# Altium project zxevo.PrjPcb (part 1 of 2)
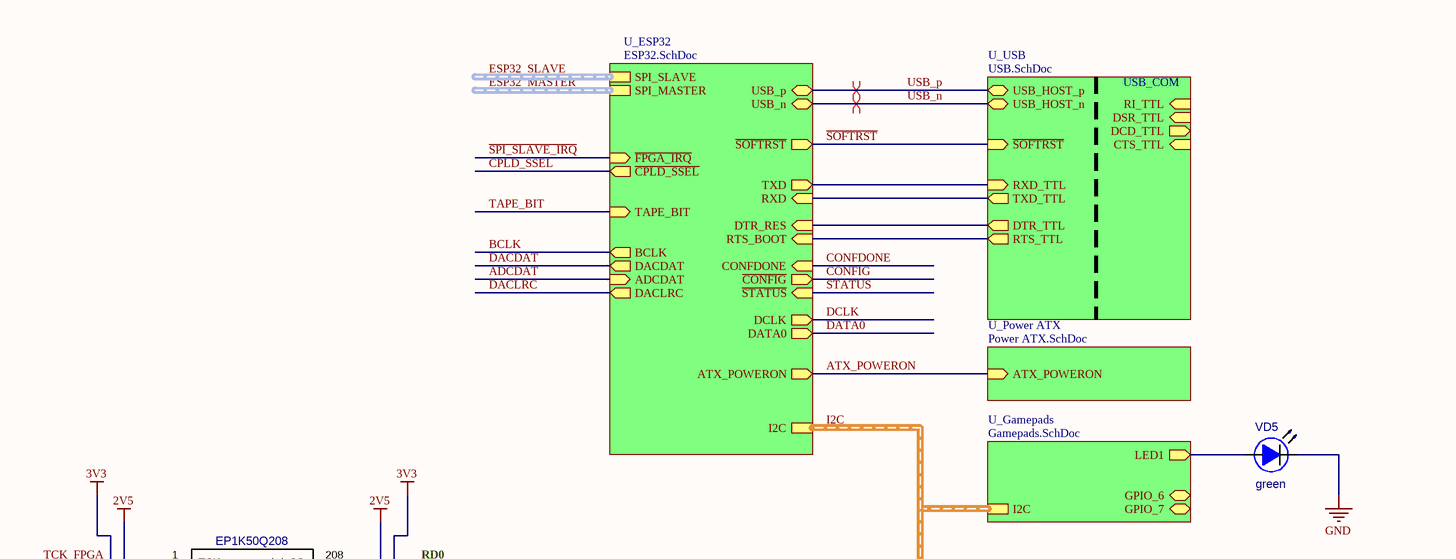
[diagram p0: FPGA.SchDoc, top]
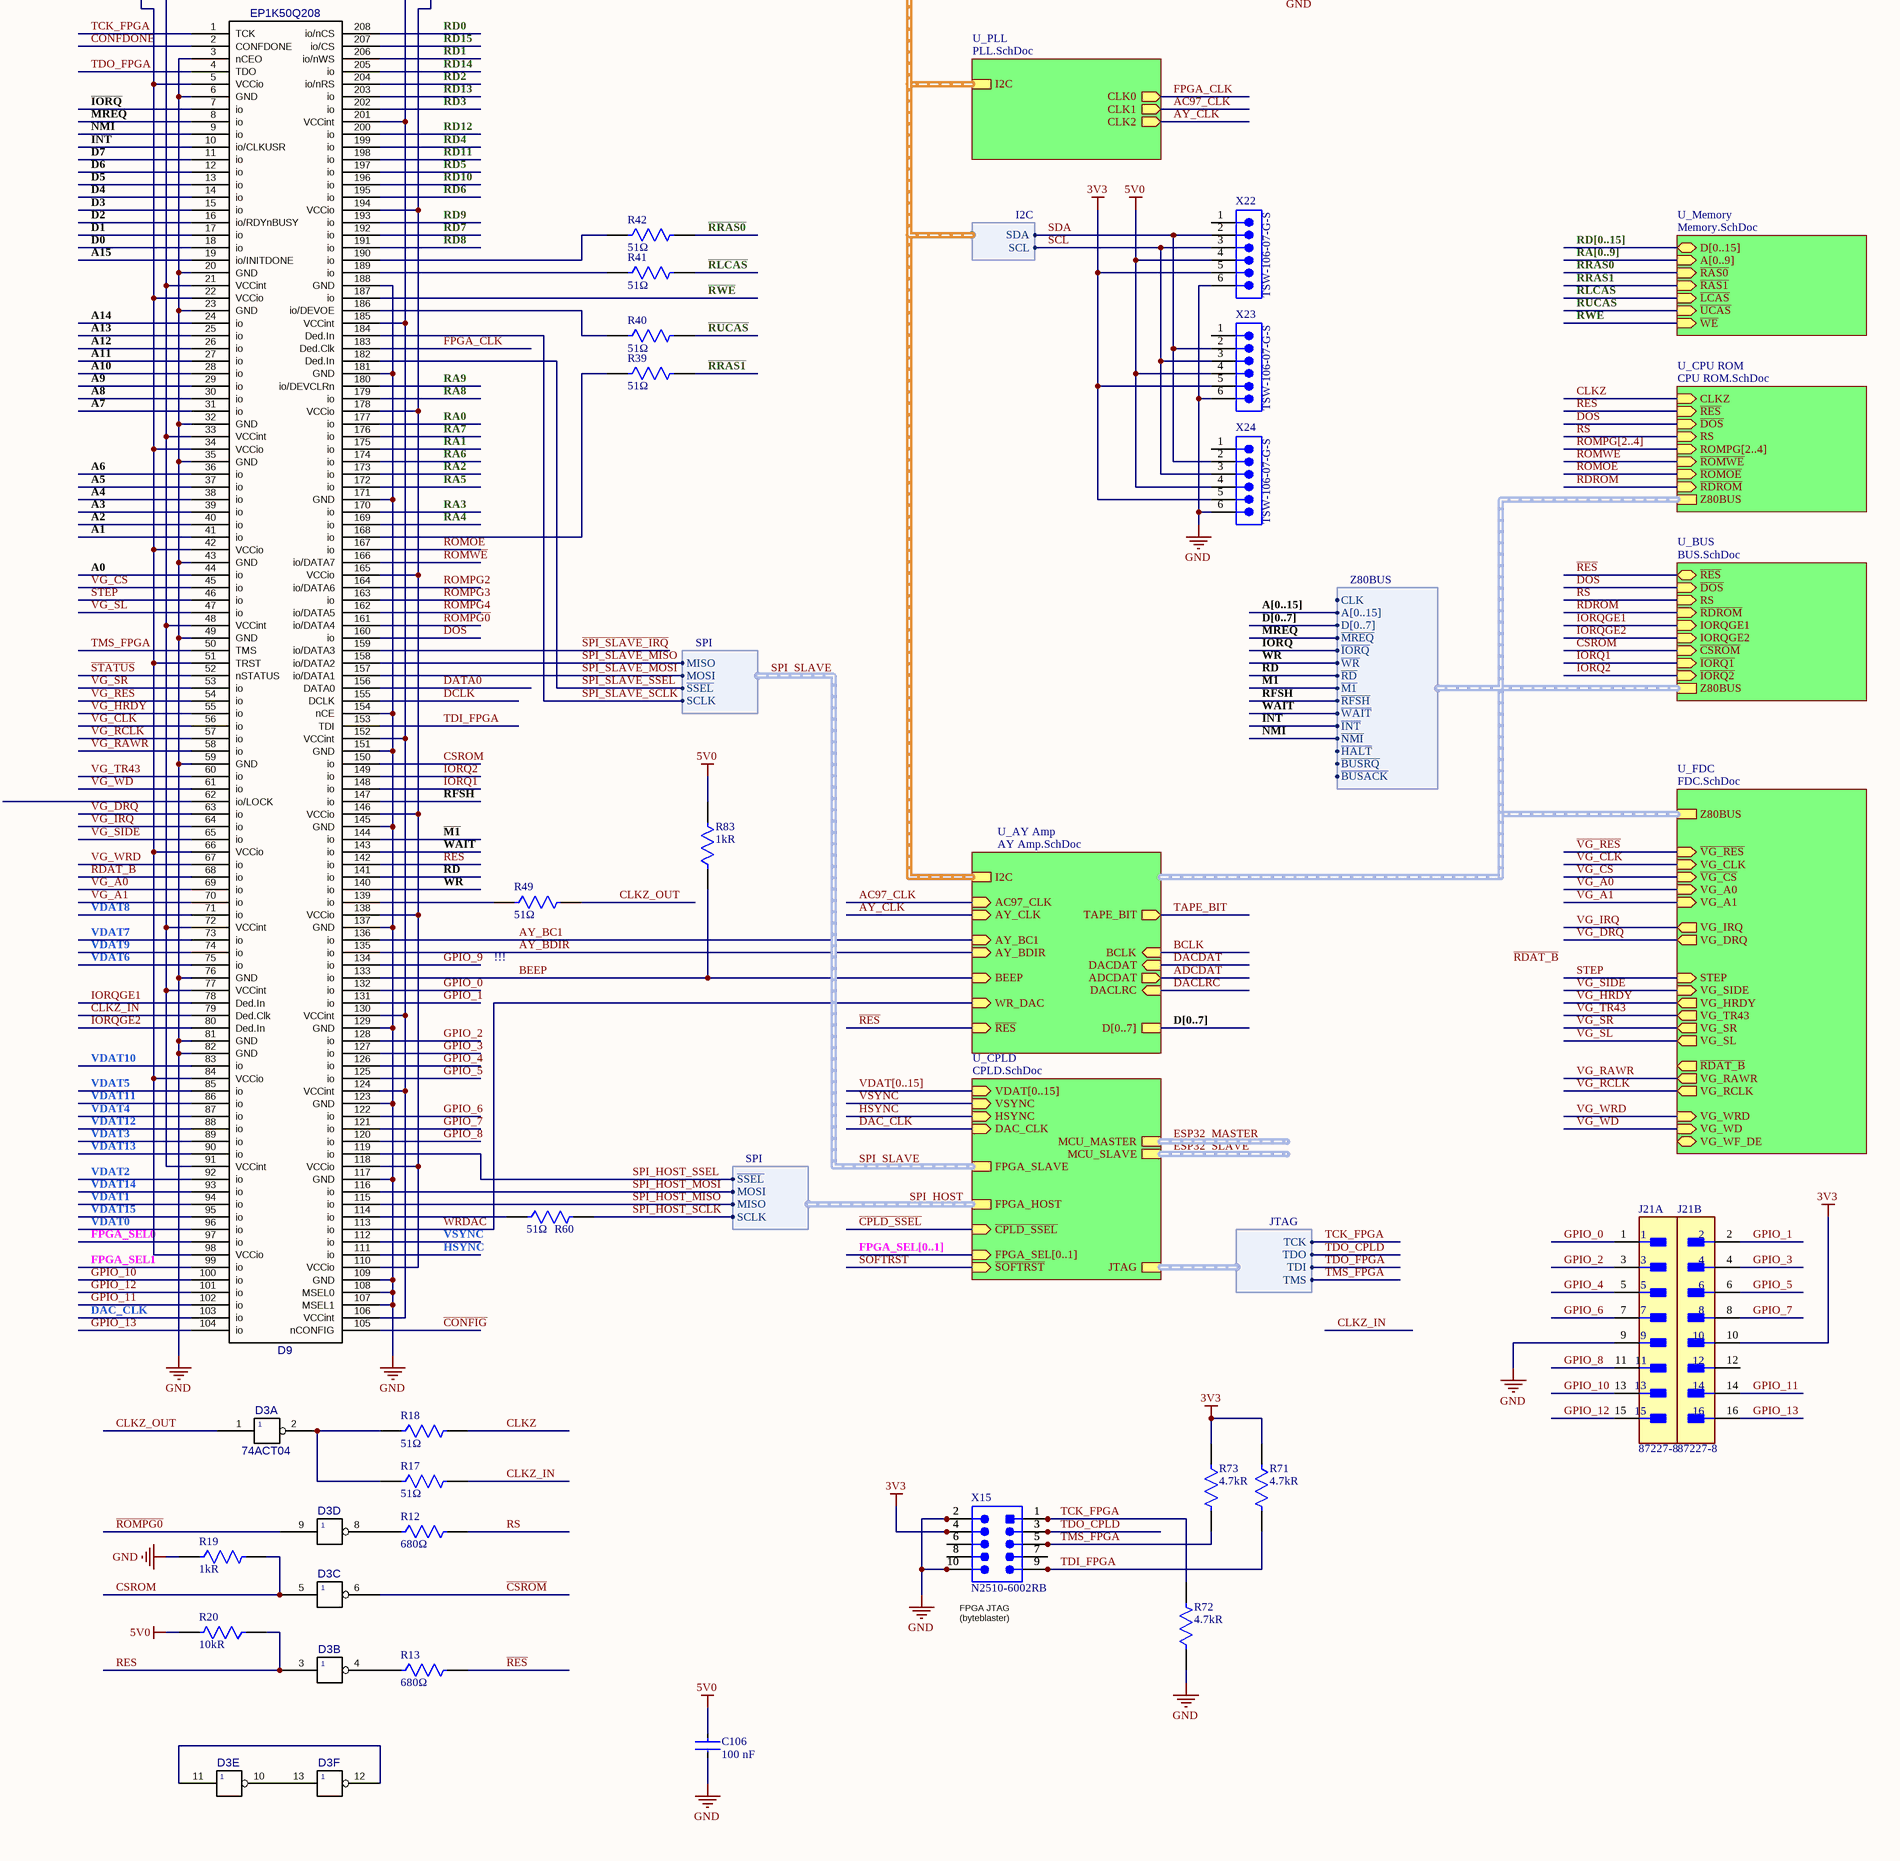
[diagram p1: FPGA.SchDoc, bottom]
9 sheets, 135 parts. Net scope: hierarchical (ports join the sheet entries above them; power ports are global).
Board file: RevA2.PcbDoc
Sheets:
  FPGA.SchDoc
    U_Memory = Memory.SchDoc
    U_BUS = BUS.SchDoc
    U_CPLD = CPLD.SchDoc
      U_Video out = Video out.SchDoc
      U_SDCARD = SDCARD.SchDoc
    U_Power ATX = Power ATX.SchDoc
    U_USB = USB.SchDoc
    U_Gamepads = Gamepads.SchDoc

## Sheet FPGA.SchDoc
size A2 portrait; SheetNumber: 1; SheetTotal: 15

### Parts
C106  Capacitance: 100 nF  [FP-CC0805-0_85-IPC_A]  (hidden comment: CC0805KRX7R9BB104)
D3  value 74ACT04  [SO14]  (hidden comment: 04)  (parts A,B,C,D,E,F of 6)
D9  EP1K50Q208  [PQFP208X5]
J21  87227-8  [FP-87227-8-MFG]  (parts A,B of 2)
R12  value 680Ω  [FP-RT0805-IPC_A]  (hidden comment: RT0805FRE07680RL)
R13  value 680Ω  [FP-RT0805-IPC_A]  (hidden comment: RT0805FRE07680RL)
R17  Resistance: 51Ω  [FP-RR1220-IPC_A]  (hidden comment: RR1220Q-510-D)
R18  Resistance: 51Ω  [FP-RR1220-IPC_A]  (hidden comment: RR1220Q-510-D)
R19  Resistance: 1kR  [FP-CRCW0805-HPe3-IPC_A]  (hidden comment: CRCW08051K00FKEAHP)
R20  Resistance: 10kR  [FP-CR0805-IPC_A]  (hidden comment: CR0805-JW-103ELF)
R39  Resistance: 51Ω  [FP-RR1220-IPC_A]  (hidden comment: RR1220Q-510-D)
R40  Resistance: 51Ω  [FP-RR1220-IPC_A]  (hidden comment: RR1220Q-510-D)
R41  Resistance: 51Ω  [FP-RR1220-IPC_A]  (hidden comment: RR1220Q-510-D)
R42  Resistance: 51Ω  [FP-RR1220-IPC_A]  (hidden comment: RR1220Q-510-D)
R49  Resistance: 51Ω  [FP-RR1220-IPC_A]  (hidden comment: RR1220Q-510-D)
R60  Resistance: 51Ω  [FP-RR1220-IPC_A]  (hidden comment: RR1220Q-510-D)
R71  Resistance: 4.7kR  [FP-CR0805-IPC_A]  (hidden comment: CR0805-JW-472ELF)
R72  Resistance: 4.7kR  [FP-CR0805-IPC_A]  (hidden comment: CR0805-JW-472ELF)
R73  Resistance: 4.7kR  [FP-CR0805-IPC_A]  (hidden comment: CR0805-JW-472ELF)
R83  Resistance: 1kR  [FP-CRCW0805-HPe3-IPC_A]  (hidden comment: CRCW08051K00FKEAHP)
VD5  value green  [LED100_LED(Primary)]  (hidden comment: LED)
X15  N2510-6002RB  [3M-N2510-6002-10_V]
X22  TSW-106-07-G-S  [SMTC-TSW-106-07-X-S]
X23  TSW-106-07-G-S  [SMTC-TSW-106-07-X-S]
X24  TSW-106-07-G-S  [SMTC-TSW-106-07-X-S]

### Sub-sheets
U_AY Amp = AY Amp.SchDoc (file not in this document): AY_BC1 (in), ~{RES} (in), AY_CLK (in), AY_BDIR (in), I2C (harness I2C), DACDAT (in), TAPE_BIT (out), ADCDAT (out), BCLK (in), BEEP (in), DACLRC (in), WR_DAC (in), D[0..7], AC97_CLK (in)
U_BUS = BUS.SchDoc: ~{RES} (bidir), ~{DOS} (in), RS (in), ~{RDROM} (in), IORQGE1 (in), IORQGE2 (in), ~{CSROM} (in), ~{IORQ1} (in), ~{IORQ2} (in), Z80BUS (harness Z80BUS)
U_CPLD = CPLD.SchDoc: VDAT[0..15] (in), VSYNC (in), HSYNC (in), DAC_CLK (in), FPGA_HOST (harness SPI), FPGA_SLAVE (harness SPI), MCU_MASTER (harness SPI), MCU_SLAVE (harness SPI), FPGA_SEL[0..1] (in), JTAG (harness JTAG), ~{SOFTRST} (in), ~{CPLD_SSEL} (in)
U_CPU ROM = CPU ROM.SchDoc (file not in this document): CLKZ (in), ~{RES} (in), ~{DOS} (in), RS (in), ROMPG[2..4] (in), ~{ROMWE} (in), ~{ROMOE} (in), ~{RDROM} (in), Z80BUS (harness Z80BUS)
U_ESP32 = ESP32.SchDoc (file not in this document): SPI_SLAVE (harness SPI), TXD (out), RXD (in), DTR_RES (in), RTS_BOOT (in), I2C (harness I2C), TAPE_BIT (in), USB_n (bidir), USB_p (bidir), SPI_MASTER (harness SPI), ~{SOFTRST} (out), ATX_POWERON (out), ~{FPGA_IRQ} (in), DCLK (out), DATA0 (out), ~{STATUS} (in), CONFDONE (in), ~{CONFIG} (out), ~{CPLD_SSEL} (out), DACLRC (out), ADCDAT (in), BCLK (out), DACDAT (out)
U_FDC = FDC.SchDoc (file not in this document): VG_CLK (in), VG_IRQ (out), VG_DRQ (out), ~{VG_CS} (in), VG_SIDE (in), STEP (in), VG_A0 (in), VG_A1 (in), VG_TR43 (out), VG_SR (out), VG_SL (out), VG_WD (in), VG_WRD (in), VG_WF_DE (bidir), VG_RAWR (out), VG_RCLK (out), ~{VG_RES} (in), VG_HRDY (out), Z80BUS (harness Z80BUS), ~{RDAT_B} (out)
U_Gamepads = Gamepads.SchDoc: GPIO_7 (bidir), LED1 (out), GPIO_6 (bidir), I2C (harness I2C)
U_Memory = Memory.SchDoc: D[0..15] (bidir), A[0..9] (in), ~{RAS0} (in), ~{RAS1} (in), ~{LCAS} (in), ~{UCAS} (in), ~{WE} (in)
U_PLL = PLL.SchDoc (file not in this document): CLK0 (out), CLK1 (out), CLK2 (out), I2C (harness I2C)
U_Power ATX = Power ATX.SchDoc: ATX_POWERON (in)
U_USB = USB.SchDoc: RXD_TTL (in), USB_HOST_p (bidir), TXD_TTL (out), RTS_TTL (out), CTS_TTL (in), DCD_TTL (out), DSR_TTL (in), USB_HOST_n (bidir), RI_TTL (in), DTR_TTL (out), ~{SOFTRST} (in)

### Harnesses
SPI: ~{SSEL}, SCLK, MOSI, MISO
JTAG: TCK, TDO, TDI, TMS
I2C: SDA, SCL
Z80BUS: A[0..15], D[0..7], ~{MREQ}, ~{IORQ}, ~{WR}, ~{RD}, ~{M1}, ~{RFSH}, ~{WAIT}, ~{INT}, ~{NMI}, ~{HALT}, ~{BUSRQ}, ~{BUSACK}, CLK

### Nets
2V5: D9.21(VCCint) D9.33(VCCint) D9.48(VCCint) D9.72(VCCint) D9.77(VCCint) D9.91(VCCint) D9.106(VCCint) D9.124(VCCint) D9.130(VCCint) D9.152(VCCint) D9.185(VCCint) D9.201(VCCint)
3V3: D9.5(VCCio) D9.22(VCCio) D9.34(VCCio) D9.42(VCCio) D9.51(TRST) D9.66(VCCio) D9.84(VCCio) D9.98(VCCio) D9.110(VCCio) D9.118(VCCio) D9.138(VCCio) D9.146(VCCio) D9.165(VCCio) D9.178(VCCio) D9.194(VCCio) J21.10 R71.1 R73.1 X15.4 X22.5 X23.5 X24.5
5V0: C106.1 R20.2 R83.2 X22.4 X23.4 X24.4
GND: C106.2 D3.7(GND) D9.3(nCEO) D9.6(GND) D9.20(GND) D9.23(GND) D9.32(GND) D9.35(GND) D9.43(GND) D9.49(GND) D9.59(GND) D9.76(GND) D9.81(GND) D9.82(GND) D9.107(MSEL1) D9.108(MSEL0) D9.109(GND) D9.117(GND) D9.123(GND) D9.129(GND) D9.137(GND) D9.145(GND) D9.151(GND) D9.154(nCE) D9.171(GND) D9.181(GND) D9.188(GND) J21.9 R19.1 R72.1 VD5.K X15.2 X15.10 X22.6 X23.6 X24.6
VCC5: D3.14(+5v)
A0: D9.44(io)
A1: D9.41(io)
A2: D9.40(io)
A3: D9.39(io)
A4: D9.38(io)
A5: D9.37(io)
A6: D9.36(io)
A7: D9.31(io)
A8: D9.30(io)
A9: D9.29(io)
A10: D9.28(io)
A11: D9.27(io)
A12: D9.26(io)
A13: D9.25(io)
A14: D9.24(io)
A15: D9.19(io/INITDONE)
AC97_CLK: sheet U_AY Amp/AC97_CLK, sheet U_PLL/CLK1
ADCDAT: sheet U_ESP32/ADCDAT, sheet U_AY Amp/ADCDAT
ATX_POWERON: sheet U_Power ATX/ATX_POWERON, sheet U_ESP32/ATX_POWERON
AY_BC1: D9.136(io) ; sheet U_AY Amp/AY_BC1
AY_BDIR: D9.135(io) ; sheet U_AY Amp/AY_BDIR
AY_CLK: sheet U_AY Amp/AY_CLK, sheet U_PLL/CLK2
BCLK: sheet U_ESP32/BCLK, sheet U_AY Amp/BCLK
BEEP: D9.133(io) R83.1 ; sheet U_AY Amp/BEEP
~{CONFIG}: D9.105(nCONFIG) ; sheet U_ESP32/~{CONFIG}
~{CPLD_SSEL}: sheet U_CPLD/~{CPLD_SSEL}, sheet U_ESP32/~{CPLD_SSEL}
~{CSROM}: D3.6 ; sheet U_BUS/~{CSROM}
CLKZ: R18.2 ; sheet U_CPU ROM/CLKZ
CLKZ_IN: D9.79(Ded.Clk) R17.2  [project net CLKZ_IN_1]
CLKZ_OUT: D3.1 R49.2  [project net CLKZ_OUT_1]
CONFDONE: D9.2(CONFDONE) ; sheet U_ESP32/CONFDONE
CSROM: D3.5 D9.150(io) R19.2  [project net CSROM_1]
D0: D9.18(io)
D1: D9.17(io)
D2: D9.16(io/RDYnBUSY)
D3: D9.15(io)
D4: D9.14(io)
D5: D9.13(io)
D6: D9.12(io)
D7: D9.11(io)
~{DOS}: D9.160(io) ; sheet U_CPU ROM/~{DOS}, sheet U_BUS/~{DOS}
DAC_CLK: D9.103(io) ; sheet U_CPLD/DAC_CLK
DACDAT: sheet U_ESP32/DACDAT, sheet U_AY Amp/DACDAT
DACLRC: sheet U_ESP32/DACLRC, sheet U_AY Amp/DACLRC
DATA0: D9.156(DATA0) ; sheet U_ESP32/DATA0
DCLK: D9.155(DCLK) ; sheet U_ESP32/DCLK
DTR_TTL: sheet U_USB/DTR_TTL, sheet U_ESP32/DTR_RES
FPGA_CLK: D9.183(Ded.Clk) ; sheet U_PLL/CLK0
FPGA_SEL0: D9.97(io)
FPGA_SEL1: D9.99(io)
GPIO_0: D9.132(io) J21.1  [project net GPIO_0_1]
GPIO_1: D9.131(io) J21.2  [project net GPIO_1_1]
GPIO_2: D9.128(io) J21.3  [project net GPIO_2_1]
GPIO_3: D9.127(io) J21.4  [project net GPIO_3_1]
GPIO_4: D9.126(io) J21.5  [project net GPIO_4_1]
GPIO_5: D9.125(io) J21.6  [project net GPIO_5_1]
GPIO_6: D9.122(io) J21.7  [project net GPIO_6_1]
GPIO_7: D9.121(io) J21.8  [project net GPIO_7_1]
GPIO_8: D9.120(io) J21.11  [project net GPIO_8_1]
GPIO_9: D9.134(io)  [project net GPIO_9_1]
GPIO_10: D9.100(io) J21.13  [project net GPIO_10_1]
GPIO_11: D9.102(io) J21.14  [project net GPIO_11_1]
GPIO_12: D9.101(io) J21.15  [project net GPIO_12_1]
GPIO_13: D9.104(io) J21.16  [project net GPIO_13_1]
HSYNC: D9.111(io) ; sheet U_CPLD/HSYNC
~{INT}: D9.10(io/CLKUSR) ; sheet U_CPU ROM/Z80BUS.~{INT}
~{IORQ}: D9.7(io) ; sheet U_CPU ROM/Z80BUS.~{IORQ}
~{IORQ1}: D9.148(io) ; sheet U_BUS/~{IORQ1}
~{IORQ2}: D9.149(io) ; sheet U_BUS/~{IORQ2}
IORQGE1: D9.78(Ded.In) ; sheet U_BUS/IORQGE1
IORQGE2: D9.80(Ded.In) ; sheet U_BUS/IORQGE2
~{M1}: D9.144(io) ; sheet U_CPU ROM/Z80BUS.~{M1}
~{MREQ}: D9.8(io) ; sheet U_CPU ROM/Z80BUS.~{MREQ}
~{NMI}: D9.9(io) ; sheet U_CPU ROM/Z80BUS.~{NMI}
~{RD}: D9.141(io) ; sheet U_CPU ROM/Z80BUS.~{RD}
~{RDAT_B}: D9.68(io)  [project net ~{RDAT_B}_1]
~{RDROM}: sheet U_CPU ROM/~{RDROM}, sheet U_BUS/~{RDROM}
~{RES}: R13.2 ; sheet U_CPU ROM/~{RES}, sheet U_BUS/~{RES}, sheet U_AY Amp/~{RES}
~{RFSH}: D9.147(io) ; sheet U_CPU ROM/Z80BUS.~{RFSH}
~{RLCAS}: R41.2 ; sheet U_Memory/~{LCAS}
~{ROMOE}: D9.167(io) ; sheet U_CPU ROM/~{ROMOE}
~{ROMPG0}: D3.9 D9.161(io/DATA4)  [project net ~{ROMPG0}_1]
~{ROMWE}: D9.166(io/DATA7) ; sheet U_CPU ROM/~{ROMWE}
~{RRAS0}: R42.2 ; sheet U_Memory/~{RAS0}
~{RRAS1}: R39.2 ; sheet U_Memory/~{RAS1}
~{RUCAS}: R40.2 ; sheet U_Memory/~{UCAS}
~{RWE}: D9.187(io) ; sheet U_Memory/~{WE}
RA0: D9.177(io)
RA1: D9.175(io)
RA2: D9.173(io)
RA3: D9.170(io)
RA4: D9.169(io)
RA5: D9.172(io)
RA6: D9.174(io)
RA7: D9.176(io)
RA8: D9.179(io)
RA9: D9.180(io/DEVCLRn)
RD0: D9.208(io/nCS)
RD1: D9.206(io/nWS)
RD2: D9.204(io/nRS)
RD3: D9.202(io)
RD4: D9.199(io)
RD5: D9.197(io)
RD6: D9.195(io)
RD7: D9.192(io)
RD8: D9.191(io)
RD9: D9.193(io)
RD10: D9.196(io)
RD11: D9.198(io)
RD12: D9.200(io)
RD13: D9.203(io)
RD14: D9.205(io)
RD15: D9.207(io/CS)
RES: D3.3 D9.142(io) R20.1  [project net RES_1]
ROMPG2: D9.164(io/DATA6)  [project net ROMPG2_1]
ROMPG3: D9.163(io)  [project net ROMPG3_1]
ROMPG4: D9.162(io/DATA5)  [project net ROMPG4_1]
RS: R12.2 ; sheet U_CPU ROM/RS, sheet U_BUS/RS
RTS_TTL: sheet U_USB/RTS_TTL, sheet U_ESP32/RTS_BOOT
RXD_TTL: sheet U_USB/RXD_TTL, sheet U_ESP32/TXD
~{SOFTRST}: sheet U_CPLD/~{SOFTRST}, sheet U_USB/~{SOFTRST}, sheet U_ESP32/~{SOFTRST}
~{SPI_SLAVE_IRQ}: D9.159(io/DATA3) ; sheet U_ESP32/~{FPGA_IRQ}
~{SPI_SLAVE_SSEL}: D9.182(Ded.In) ; sheet U_CPLD/FPGA_SLAVE.~{SSEL}
~{STATUS}: D9.52(nSTATUS) ; sheet U_ESP32/~{STATUS}
SCL: X22.3 X23.3 X24.3 ; sheet U_ESP32/I2C.SCL  [project net I2C.SCL]
SDA: X22.2 X23.2 X24.2 ; sheet U_ESP32/I2C.SDA  [project net I2C.SDA]
SPI_HOST_MISO: D9.115(io) ; sheet U_CPLD/FPGA_HOST.MISO  [project net SPI_HOST.MISO]
SPI_HOST_MOSI: D9.116(io) ; sheet U_CPLD/FPGA_HOST.MOSI  [project net SPI_HOST.MOSI]
SPI_HOST_SCLK: R60.2 ; sheet U_CPLD/FPGA_HOST.SCLK  [project net SPI_HOST.SCLK]
SPI_HOST_SSEL: D9.119(io) ; sheet U_CPLD/FPGA_HOST.~{SSEL}  [project net SPI_HOST.~{SSEL}]
SPI_SLAVE_MISO: D9.158(io/DATA2) ; sheet U_CPLD/FPGA_SLAVE.MISO  [project net SPI_SLAVE.MISO]
SPI_SLAVE_MOSI: D9.157(io/DATA1) ; sheet U_CPLD/FPGA_SLAVE.MOSI  [project net SPI_SLAVE.MOSI]
SPI_SLAVE_SCLK: D9.184(Ded.In) ; sheet U_CPLD/FPGA_SLAVE.SCLK  [project net SPI_SLAVE.SCLK]
STEP: D9.46(io) ; sheet U_FDC/STEP
TAPE_BIT: sheet U_ESP32/TAPE_BIT, sheet U_AY Amp/TAPE_BIT
TCK_FPGA: D9.1(TCK) R72.2 X15.1 ; sheet U_CPLD/JTAG.TCK
TDI_FPGA: D9.153(TDI) R71.2 X15.9  [project net TDI_FPGA_1]
TDO_CPLD: X15.3 ; sheet U_CPLD/JTAG.TDO
TDO_FPGA: D9.4(TDO) ; sheet U_CPLD/JTAG.TDI
TMS_FPGA: D9.50(TMS) R73.2 X15.5 ; sheet U_CPLD/JTAG.TMS
TXD_TTL: sheet U_USB/TXD_TTL, sheet U_ESP32/RXD
USB_n: sheet U_USB/USB_HOST_n, sheet U_ESP32/USB_n
USB_p: sheet U_USB/USB_HOST_p, sheet U_ESP32/USB_p
~{VG_CS}: D9.45(io) ; sheet U_FDC/~{VG_CS}
~{VG_RES}: D9.54(io) ; sheet U_FDC/~{VG_RES}
VDAT0: D9.96(io)
VDAT1: D9.94(io)
VDAT2: D9.92(io)
VDAT3: D9.89(io)
VDAT4: D9.87(io)
VDAT5: D9.85(io)
VDAT6: D9.75(io)
VDAT7: D9.73(io)
VDAT8: D9.71(io)
VDAT9: D9.74(io)
VDAT10: D9.83(io)
VDAT11: D9.86(io)
VDAT12: D9.88(io)
VDAT13: D9.90(io)
VDAT14: D9.93(io)
VDAT15: D9.95(io)
VG_A0: D9.69(io) ; sheet U_FDC/VG_A0
VG_A1: D9.70(io) ; sheet U_FDC/VG_A1
VG_CLK: D9.56(io) ; sheet U_FDC/VG_CLK
VG_DRQ: D9.63(io) ; sheet U_FDC/VG_DRQ
VG_HRDY: D9.55(io) ; sheet U_FDC/VG_HRDY
VG_IRQ: D9.64(io) ; sheet U_FDC/VG_IRQ
VG_RAWR: D9.58(io) ; sheet U_FDC/VG_RAWR
VG_RCLK: D9.57(io) ; sheet U_FDC/VG_RCLK
VG_SIDE: D9.65(io) ; sheet U_FDC/VG_SIDE
VG_SL: D9.47(io) ; sheet U_FDC/VG_SL
VG_SR: D9.53(io) ; sheet U_FDC/VG_SR
VG_TR43: D9.60(io) ; sheet U_FDC/VG_TR43
VG_WD: D9.61(io) ; sheet U_FDC/VG_WD
VG_WRD: D9.67(io) ; sheet U_FDC/VG_WRD
VSYNC: D9.112(io) ; sheet U_CPLD/VSYNC
~{WAIT}: D9.143(io) ; sheet U_CPU ROM/Z80BUS.~{WAIT}
~{WR}: D9.140(io) ; sheet U_CPU ROM/Z80BUS.~{WR}
WRDAC: D9.113(io) ; sheet U_AY Amp/WR_DAC
NetD3_2: D3.2 R17.1 R18.1
NetD3_4: D3.4 R13.1
NetD3_8: D3.8 R12.1
NetD3_10: D3.10 D3.13
NetD3_11: D3.11 D3.12
NetD9_114: D9.114(io) R60.1
NetD9_139: D9.139(io) R49.1
NetD9_168: D9.168(io) R39.1
NetD9_186: D9.186(io/DEVOE) R40.1
NetD9_189: D9.189(io) R41.1
NetD9_190: D9.190(io) R42.1
NetR74_1: VD5.A ; sheet U_Gamepads/LED1

Not connected (* = marked no-connect by the designer): D9 62(io/LOCK); J21 12; X15 6 7 8; X22 1; X23 1; X24 1

### Buses and harness runs
bus A[0..15]
bus D[0..7]
bus D[0..7] = sheet U_AY Amp/D[0..7]
bus FPGA_SEL[0..1] = sheet U_CPLD/FPGA_SEL[0..1]
bus RA[0..9] = sheet U_Memory/A[0..9]
bus RD[0..15] = sheet U_Memory/D[0..15]
bus ROMPG[2..4] = sheet U_CPU ROM/ROMPG[2..4]
bus VDAT[0..15] = sheet U_CPLD/VDAT[0..15]
harness ESP32_MASTER = sheet U_CPLD/MCU_MASTER
harness ESP32_MASTER = sheet U_ESP32/SPI_MASTER
harness ESP32_SLAVE = sheet U_CPLD/MCU_SLAVE
harness ESP32_SLAVE = sheet U_ESP32/SPI_SLAVE
harness I2C = sheet U_AY Amp/I2C = sheet U_ESP32/I2C = sheet U_Gamepads/I2C = sheet U_PLL/I2C
harness sheet U_BUS/Z80BUS = sheet U_CPU ROM/Z80BUS = sheet U_FDC/Z80BUS
harness SPI_HOST = sheet U_CPLD/FPGA_HOST
harness SPI_SLAVE = sheet U_CPLD/FPGA_SLAVE

### Layout directives
differential pair: USB_n, USB_p

### Notes on the sheet
- USB_COM
- !!!
- (near X15) FPGA JTAG
  (byteblaster)
- Labels drawn without touching a wire or pin: ~{RDAT_B}

### Library data of the parts
C106 = CMP-2100-03606-3: CAP CER 0.1UF 50V X7R 0805; Manufacturer: Yageo; Value: 100 nF; Manufacturer Part Number: CC0805KRX7R9BB104; Category: Cap; Case/Package: 0805
J21 = CMP-03369-000064-1: CONN HEADER VERT 16POS 2.54MM; Manufacturer: TE Connectivity; value: HEADER 16POS 2.54MM 2ROW; Pitch: 2.54mm; Manufacturer Part Number: 87227-8; Category: Connector; Case/Package: PLD-16
R12 R13 = CMP-03412-000082-1: RES SMD 680 OHM 1% 1/8W 0805; Manufacturer: Yageo; Category: Res; Manufacturer Part Number: RT0805FRE07680RL; Resistance: 680Ω; Case/Package: 0805
R17 R18 R39-R42 R49 R60 = CMP-2001-03561-2: 51Ω ±0.5% 0.1W 1/10W Chip Resistor 0805 (2012 Metric) Thin Film; Manufacturer: Susumu; Case/Package: 0805; Number of Terminations: 2; Termination: SMD/SMT; Number of Pins: 2; Manufacturer Part Number: RR1220Q-510-D; value: 51Ω; Category: Res
R19 R83 = CMP-02407-004529-1: RES Thick Film, 1kΩ, 1%, 0.5W, 100ppm/°C, 0805; Manufacturer: Vishay Dale; Case/Package: 0805; Number of Pins: 2; Termination: Solder; Manufacturer Part Number: CRCW08051K00FKEAHP; value: 1kΩ; Category: Res
R20 = CMP-07231-003873-1: Thick Film Chip Resistors 0805 10kΩ 0.125W 5% 200ppm/°C; Manufacturer: Bourns; value: 10kΩ; Manufacturer Part Number: CR0805-JW-103ELF; Number of Terminations: 2; Termination: SMD/SMT; Number of Pins: 2; Case/Package: 0805; Category: Res
R71-R73 = CMP-07231-004713-1: Thick Film Chip Resistors 0805 4.7kΩ 0.125W 5% 200ppm/°C; Manufacturer: Bourns; Case/Package: 0805; Number of Terminations: 2; Termination: SMD/SMT; Manufacturer Part Number: CR0805-JW-472ELF; value: 4.7kΩ; Category: Res
VD5 = LED: Light Emitting Diode; Category: Diode
X15 = CMP-2000-06794-1: Male Header, Pitch 2.54 mm, 2 x 5 Postion, Height 9.91 mm, Tail Length 2.84 mm, -55 to 105 degC, RoHS, Bulk; PartNumber: N2510; Manufacturer: 3M; Pitch: 2.54mm; value: 10-Pin Shrouded Header, 2.54mm; Manufacturer Part Number: N2510-6002RB; Case/Package: IDC-10; Category: Connector
X22-X24 = CMP-1024-00383-1: 0.025" SQ Post Header, Through-hole, Vertical, -55 to 125 degC, 2.54 mm Pitch, 6-Pin, Male, RoHS; Manufacturer: Samtec; Pitch: 2.54 mm; value: 6 pin header 2.54mm; PackageDescription: .025[0.64] SQ. Post Terminal Strip Assembly; PartNumber: TSW-106-07-G-S; Manufacturer Part Number: TSW-106-07-G-S; Case/Package: PLS-6; Category: Connector
D3 = 04: Case/Package: SOIC-14; Category: IC
D9 = EP1K50Q208: Value: EP1K50Q208; Case/Package: PQFP-208; Category: IC

## Sheet Memory.SchDoc
size A4; SheetNumber: 6; SheetTotal: 15
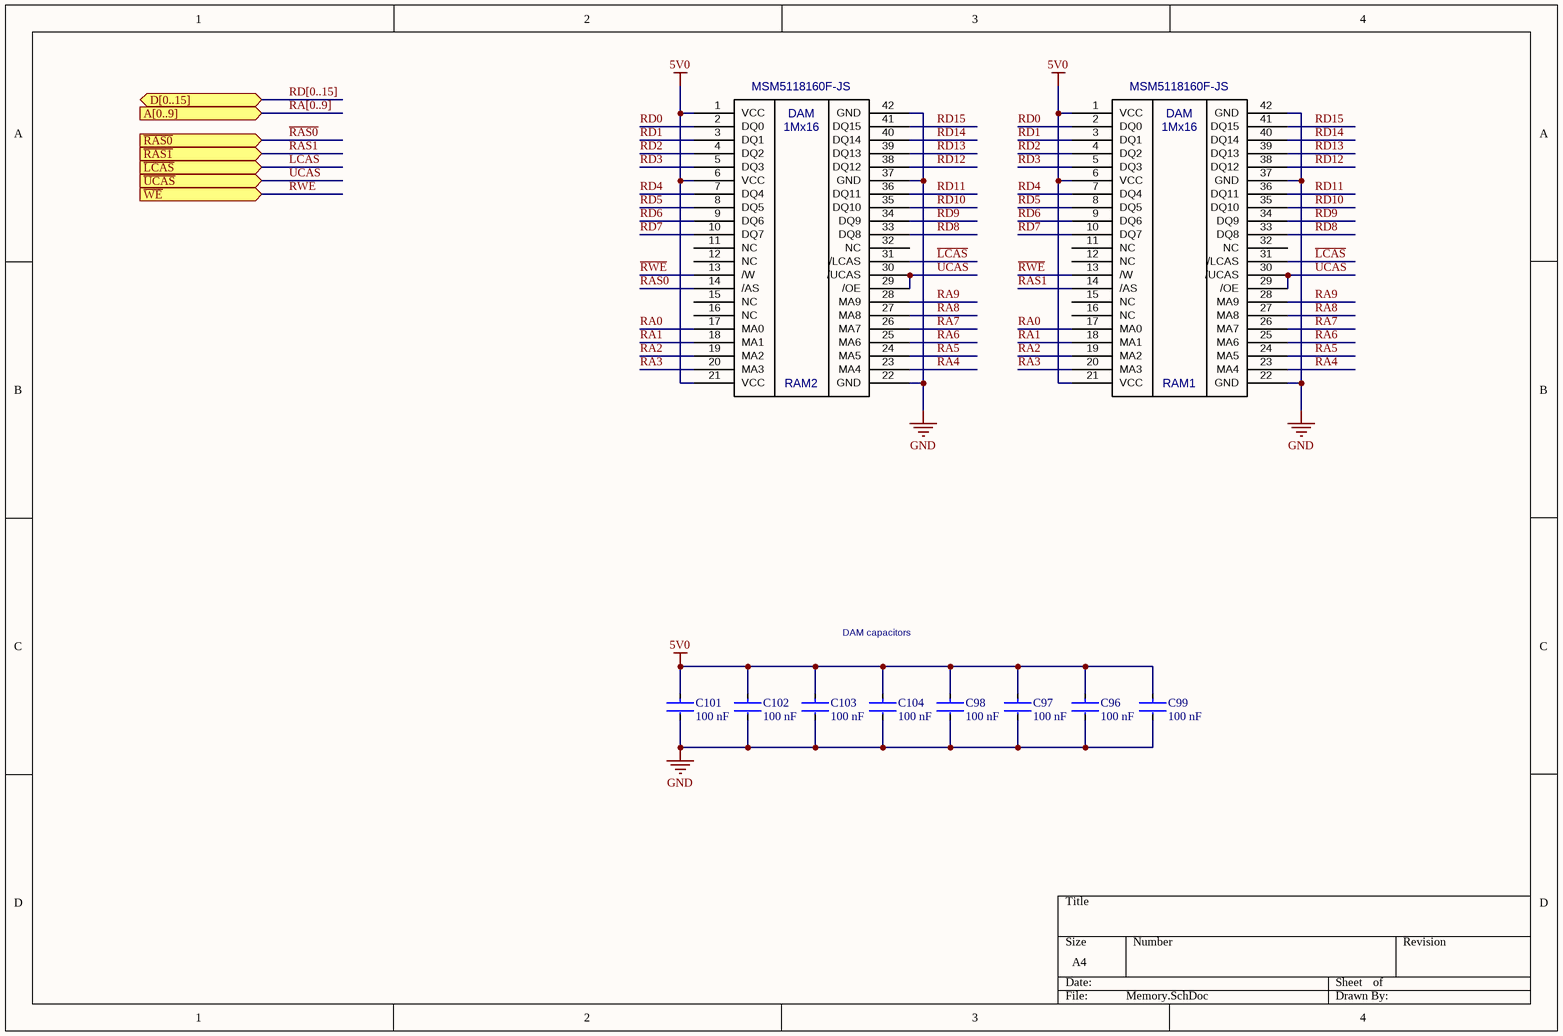
[diagram p2: Memory.SchDoc]

### Parts
C96  Capacitance: 100 nF  [FP-CC0805-0_85-IPC_A]  (hidden comment: CC0805KRX7R9BB104)
C97  Capacitance: 100 nF  [FP-CC0805-0_85-IPC_A]  (hidden comment: CC0805KRX7R9BB104)
C98  Capacitance: 100 nF  [FP-CC0805-0_85-IPC_A]  (hidden comment: CC0805KRX7R9BB104)
C99  Capacitance: 100 nF  [FP-CC0805-0_85-IPC_A]  (hidden comment: CC0805KRX7R9BB104)
C101  Capacitance: 100 nF  [FP-CC0805-0_85-IPC_A]  (hidden comment: CC0805KRX7R9BB104)
C102  Capacitance: 100 nF  [FP-CC0805-0_85-IPC_A]  (hidden comment: CC0805KRX7R9BB104)
C103  Capacitance: 100 nF  [FP-CC0805-0_85-IPC_A]  (hidden comment: CC0805KRX7R9BB104)
C104  Capacitance: 100 nF  [FP-CC0805-0_85-IPC_A]  (hidden comment: CC0805KRX7R9BB104)
RAM1  MSM5118160F-JS  [SOJ42]
RAM2  MSM5118160F-JS  [SOJ42]

### Ports
A[0..9] (in), D[0..15] (bidir), ~{LCAS} (in), ~{RAS0} (in), ~{RAS1} (in), ~{UCAS} (in), ~{WE} (in)

### Nets
5V0: C96.1 C97.1 C98.1 C99.1 C101.1 C102.1 C103.1 C104.1 RAM1.1(VCC) RAM1.6(VCC) RAM1.21(VCC) RAM2.1(VCC) RAM2.6(VCC) RAM2.21(VCC)
GND: C96.2 C97.2 C98.2 C99.2 C101.2 C102.2 C103.2 C104.2 RAM1.22(GND) RAM1.37(GND) RAM1.42(GND) RAM2.22(GND) RAM2.37(GND) RAM2.42(GND)
~{LCAS}: RAM1.31(/LCAS) RAM2.31(/LCAS) ; port ~{LCAS}  [project net ~{RLCAS}]
~{RAS0}: RAM2.14(/AS) ; port ~{RAS0}  [project net ~{RRAS0}]
~{RAS1}: RAM1.14(/AS) ; port ~{RAS1}  [project net ~{RRAS1}]
~{RWE}: RAM1.13(/W) RAM2.13(/W) ; port ~{WE}
RA0: RAM1.17(MA0) RAM2.17(MA0)
RA1: RAM1.18(MA1) RAM2.18(MA1)
RA2: RAM1.19(MA2) RAM2.19(MA2)
RA3: RAM1.20(MA3) RAM2.20(MA3)
RA4: RAM1.23(MA4) RAM2.23(MA4)
RA5: RAM1.24(MA5) RAM2.24(MA5)
RA6: RAM1.25(MA6) RAM2.25(MA6)
RA7: RAM1.26(MA7) RAM2.26(MA7)
RA8: RAM1.27(MA8) RAM2.27(MA8)
RA9: RAM1.28(MA9) RAM2.28(MA9)
RD0: RAM1.2(DQ0) RAM2.2(DQ0)
RD1: RAM1.3(DQ1) RAM2.3(DQ1)
RD2: RAM1.4(DQ2) RAM2.4(DQ2)
RD3: RAM1.5(DQ3) RAM2.5(DQ3)
RD4: RAM1.7(DQ4) RAM2.7(DQ4)
RD5: RAM1.8(DQ5) RAM2.8(DQ5)
RD6: RAM1.9(DQ6) RAM2.9(DQ6)
RD7: RAM1.10(DQ7) RAM2.10(DQ7)
RD8: RAM1.33(DQ8) RAM2.33(DQ8)
RD9: RAM1.34(DQ9) RAM2.34(DQ9)
RD10: RAM1.35(DQ10) RAM2.35(DQ10)
RD11: RAM1.36(DQ11) RAM2.36(DQ11)
RD12: RAM1.38(DQ12) RAM2.38(DQ12)
RD13: RAM1.39(DQ13) RAM2.39(DQ13)
RD14: RAM1.40(DQ14) RAM2.40(DQ14)
RD15: RAM1.41(DQ15) RAM2.41(DQ15)
~{UCAS}: RAM1.29(/OE) RAM1.30(/UCAS) RAM2.29(/OE) RAM2.30(/UCAS) ; port ~{UCAS}  [project net ~{RUCAS}]

Not connected (* = marked no-connect by the designer): RAM1 11(NC) 12(NC) 15(NC) 16(NC) 32(NC); RAM2 11(NC) 12(NC) 15(NC) 16(NC) 32(NC)

### Buses and harness runs
bus RA[0..9] = port A[0..9]
bus RD[0..15] = port D[0..15]

### Notes on the sheet
- DAM capacitors
- (in symbol MSM5118160F-JS) DAM; 1Mx16

### Library data of the parts
C96-C99 C101-C104 = CMP-2100-03606-3: as C106 on sheet FPGA; Manufacturer Part Number: CC0805KRX7R9BB104; Category: Cap; Case/Package: 0805
RAM1 RAM2 = MSM5118160F-JS: Value: MSM5118160F-JS; Case/Package: SOJ-42; Category: IC

## Sheet BUS.SchDoc
size A4; SheetNumber: 8; SheetTotal: 15
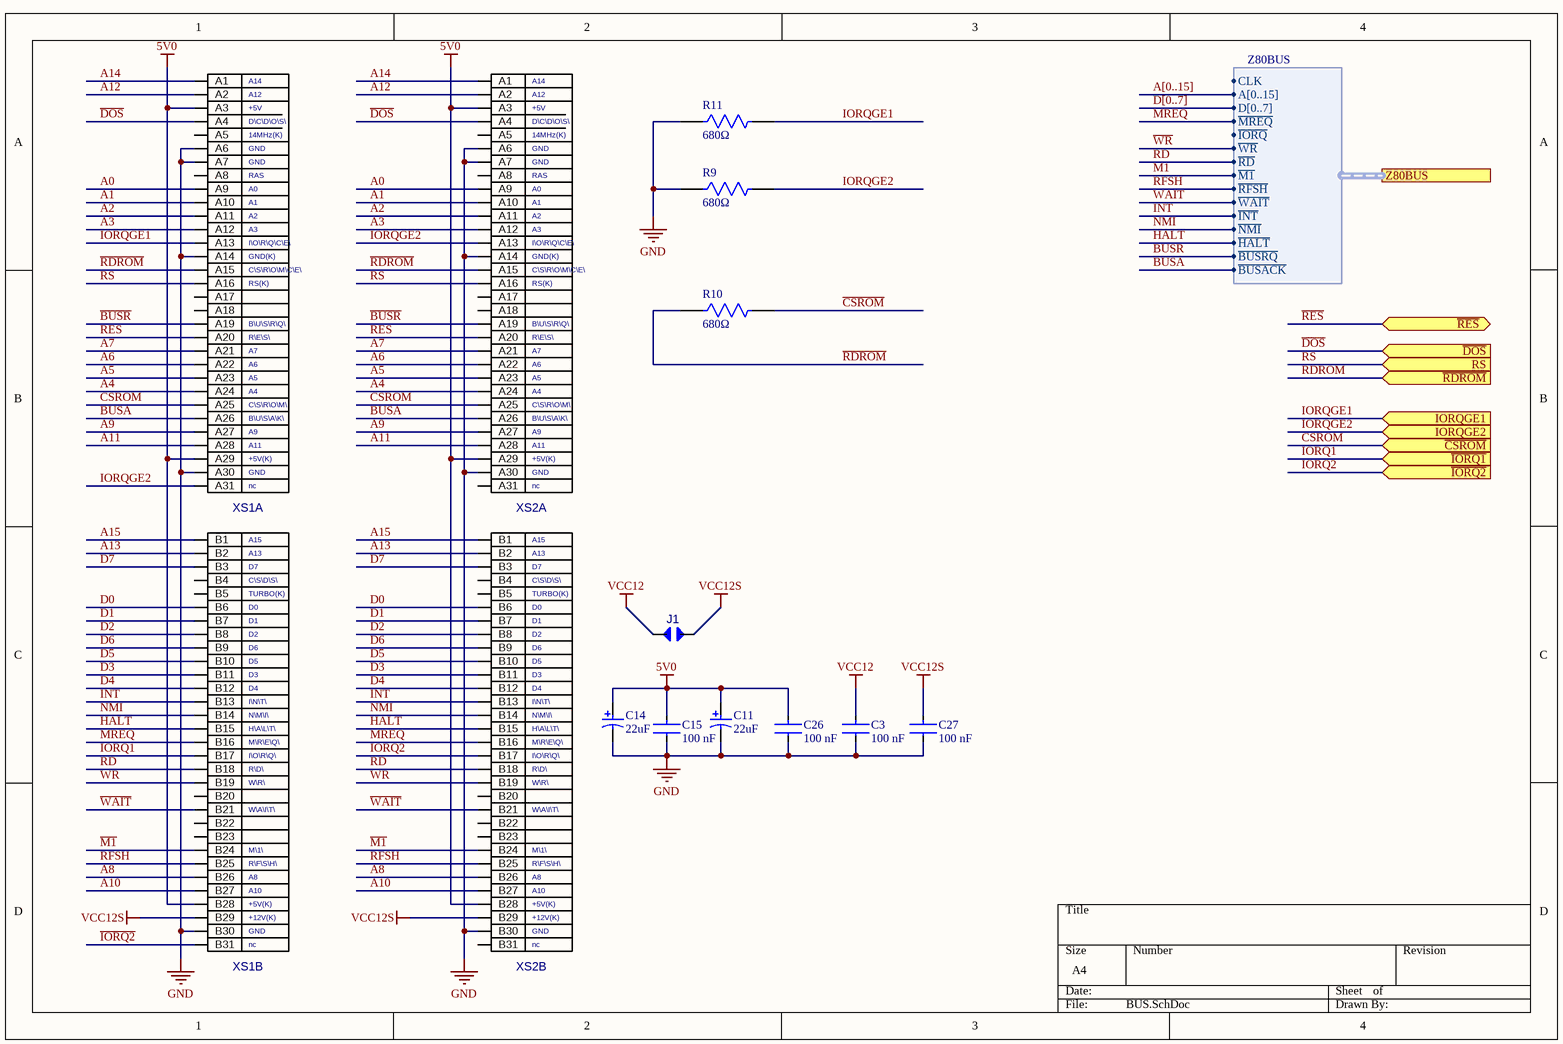
[diagram p3: BUS.SchDoc]

### Parts
C3  Capacitance: 100 nF  [FP-CC0805-0_85-IPC_A]  (hidden comment: CC0805KRX7R9BB104)
C11  Capacitance: 22uF  [AVX-TAJ-B-2_M]  (hidden comment: TAJB226K016RNJ)
C14  Capacitance: 22uF  [AVX-TAJ-B-2_M]  (hidden comment: TAJB226K016RNJ)
C15  Capacitance: 100 nF  [FP-CC0805-0_85-IPC_A]  (hidden comment: CC0805KRX7R9BB104)
C26  Capacitance: 100 nF  [FP-CC0805-0_85-IPC_A]  (hidden comment: CC0805KRX7R9BB104)
C27  Capacitance: 100 nF  [FP-CC0805-0_85-IPC_A]  (hidden comment: CC0805KRX7R9BB104)
J1  JUMPER  [JUMPER_JUMPER(Primary)]  (value not drawn)
R9  value 680Ω  [FP-RT0805-IPC_A]  (hidden comment: RT0805FRE07680RL)
R10  value 680Ω  [FP-RT0805-IPC_A]  (hidden comment: RT0805FRE07680RL)
R11  value 680Ω  [FP-RT0805-IPC_A]  (hidden comment: RT0805FRE07680RL)
XS1  ZXSLOT  [SLOT62_ZXSLOT(Primary)]  (value not drawn)  (parts A,B of 2)
XS2  ZXSLOT  [SLOT62_ZXSLOT(Primary)]  (value not drawn)  (parts A,B of 2)

### Ports
IORQGE1 (in), IORQGE2 (in), RS (in), Z80BUS (harness Z80BUS), ~{CSROM} (in), ~{DOS} (in), ~{IORQ1} (in), ~{IORQ2} (in), ~{RDROM} (in), ~{RES} (bidir)

### Harnesses
Z80BUS: A[0..15], D[0..7], ~{MREQ}, ~{IORQ}, ~{WR}, ~{RD}, ~{M1}, ~{RFSH}, ~{WAIT}, ~{INT}, ~{NMI}, ~{HALT}, ~{BUSRQ}, ~{BUSACK}, CLK

### Nets
5V0: C11.1 C14.1 C15.1 C26.1 XS1.A3 XS1.A29 XS1.B28 XS2.A3 XS2.A29 XS2.B28
GND: C3.2 C11.2 C14.2 C15.2 C26.2 C27.2 R9.1 R11.1 XS1.A6 XS1.A7 XS1.A14 XS1.A30 XS1.B30 XS2.A6 XS2.A7 XS2.A14 XS2.A30 XS2.B30
VCC12: C3.1 J1.0
VCC12S: C27.1 J1.1 XS1.B29 XS2.B29
A0: XS1.A9 XS2.A9
A1: XS1.A10 XS2.A10
A2: XS1.A11 XS2.A11
A3: XS1.A12 XS2.A12
A4: XS1.A24 XS2.A24
A5: XS1.A23 XS2.A23
A6: XS1.A22 XS2.A22
A7: XS1.A21 XS2.A21
A8: XS1.B26 XS2.B26
A9: XS1.A27 XS2.A27
A10: XS1.B27 XS2.B27
A11: XS1.A28 XS2.A28
A12: XS1.A2 XS2.A2
A13: XS1.B2 XS2.B2
A14: XS1.A1 XS2.A1
A15: XS1.B1 XS2.B1
~{BUSA}: XS1.A26 XS2.A26 ; port Z80BUS.~{BUSACK}
~{BUSR}: XS1.A19 XS2.A19 ; port Z80BUS.~{BUSRQ}
~{CSROM}: R10.2 XS1.A25 XS2.A25 ; port ~{CSROM}
D0: XS1.B6 XS2.B6
D1: XS1.B7 XS2.B7
D2: XS1.B8 XS2.B8
D3: XS1.B11 XS2.B11
D4: XS1.B12 XS2.B12
D5: XS1.B10 XS2.B10
D6: XS1.B9 XS2.B9
D7: XS1.B3 XS2.B3
~{DOS}: XS1.A4 XS2.A4 ; port ~{DOS}
~{HALT}: XS1.B15 XS2.B15 ; port Z80BUS.~{HALT}
~{INT}: XS1.B13 XS2.B13 ; port Z80BUS.~{INT}
~{IORQ1}: XS1.B17 ; port ~{IORQ1}
~{IORQ2}: XS1.B31 XS2.B17 ; port ~{IORQ2}
IORQGE1: R11.2 XS1.A13 ; port IORQGE1
IORQGE2: R9.2 XS1.A31 XS2.A13 ; port IORQGE2
~{M1}: XS1.B24 XS2.B24 ; port Z80BUS.~{M1}
~{MREQ}: XS1.B16 XS2.B16 ; port Z80BUS.~{MREQ}
~{NMI}: XS1.B14 XS2.B14 ; port Z80BUS.~{NMI}
~{RD}: XS1.B18 XS2.B18 ; port Z80BUS.~{RD}
~{RDROM}: R10.1 XS1.A15 XS2.A15 ; port ~{RDROM}
~{RES}: XS1.A20 XS2.A20 ; port ~{RES}
~{RFSH}: XS1.B25 XS2.B25 ; port Z80BUS.~{RFSH}
RS: XS1.A16 XS2.A16 ; port RS
~{WAIT}: XS1.B21 XS2.B21 ; port Z80BUS.~{WAIT}
~{WR}: XS1.B19 XS2.B19 ; port Z80BUS.~{WR}

Not connected (* = marked no-connect by the designer): XS1 A5 A8 A17 A18 B4 B5 B20 B22 B23; XS2 A5 A8 A17 A18 A31 B4 B5 B20 B22 B23 B31

### Buses and harness runs
bus A[0..15]
bus D[0..7]

### Notes on the sheet
- (in symbol ZXSLOT, part A) +5V; D\C\D\O\S\; 14MHz(K); GND; RAS; A0; I\O\R\Q\C\E\; GND(K); C\S\R\O\M\C\E\; RS(K); B\U\S\R\Q\; R\E\S\; C\S\R\O\M\; B\U\S\A\K\; +5V(K); nc
- (in symbol ZXSLOT, part B) D7; C\S\D\S\; TURBO(K); D0; D1; D2; D6; D5; D3; D4; I\N\T\; N\M\I\; H\A\L\T\; M\R\E\Q\; I\O\R\Q\; R\D\; W\R\; W\A\I\T\; M\1\; R\F\S\H\; +5V(K); +12V(K); GND; nc

### Library data of the parts
C3 C15 C26 C27 = CMP-2100-03606-3: as C106 on sheet FPGA; Manufacturer Part Number: CC0805KRX7R9BB104; Category: Cap; Case/Package: 0805
C11 C14 = CMP-2100-03689-1: Standard Tantalum, 22 uF, +/- 10%, 16 V, -55 to 125 degC, 2-Pin SMD (1210), RoHS, Tape and Reel; Manufacturer: Kyocera AVX; value: 22uF; Number of Pins: 2; Termination: SMD/SMT; Case/Package: 1210; Manufacturer Part Number: TAJB226K016RNJ; Category: Cap
J1 = JUMPER: HLT->~IP; Value: PLS-2; Case/Package: PLS-2; Category: Connector
R9-R11 = CMP-03412-000082-1: as R12 on sheet FPGA; Category: Res; Manufacturer Part Number: RT0805FRE07680RL; Resistance: 680Ω; Case/Package: 0805
XS1 XS2 = ZXSLOT: Value: ZXSLOT; Case/Package: SL62; Category: Connector

## Sheet CPLD.SchDoc
size A3; SheetNumber: 12; SheetTotal: 15
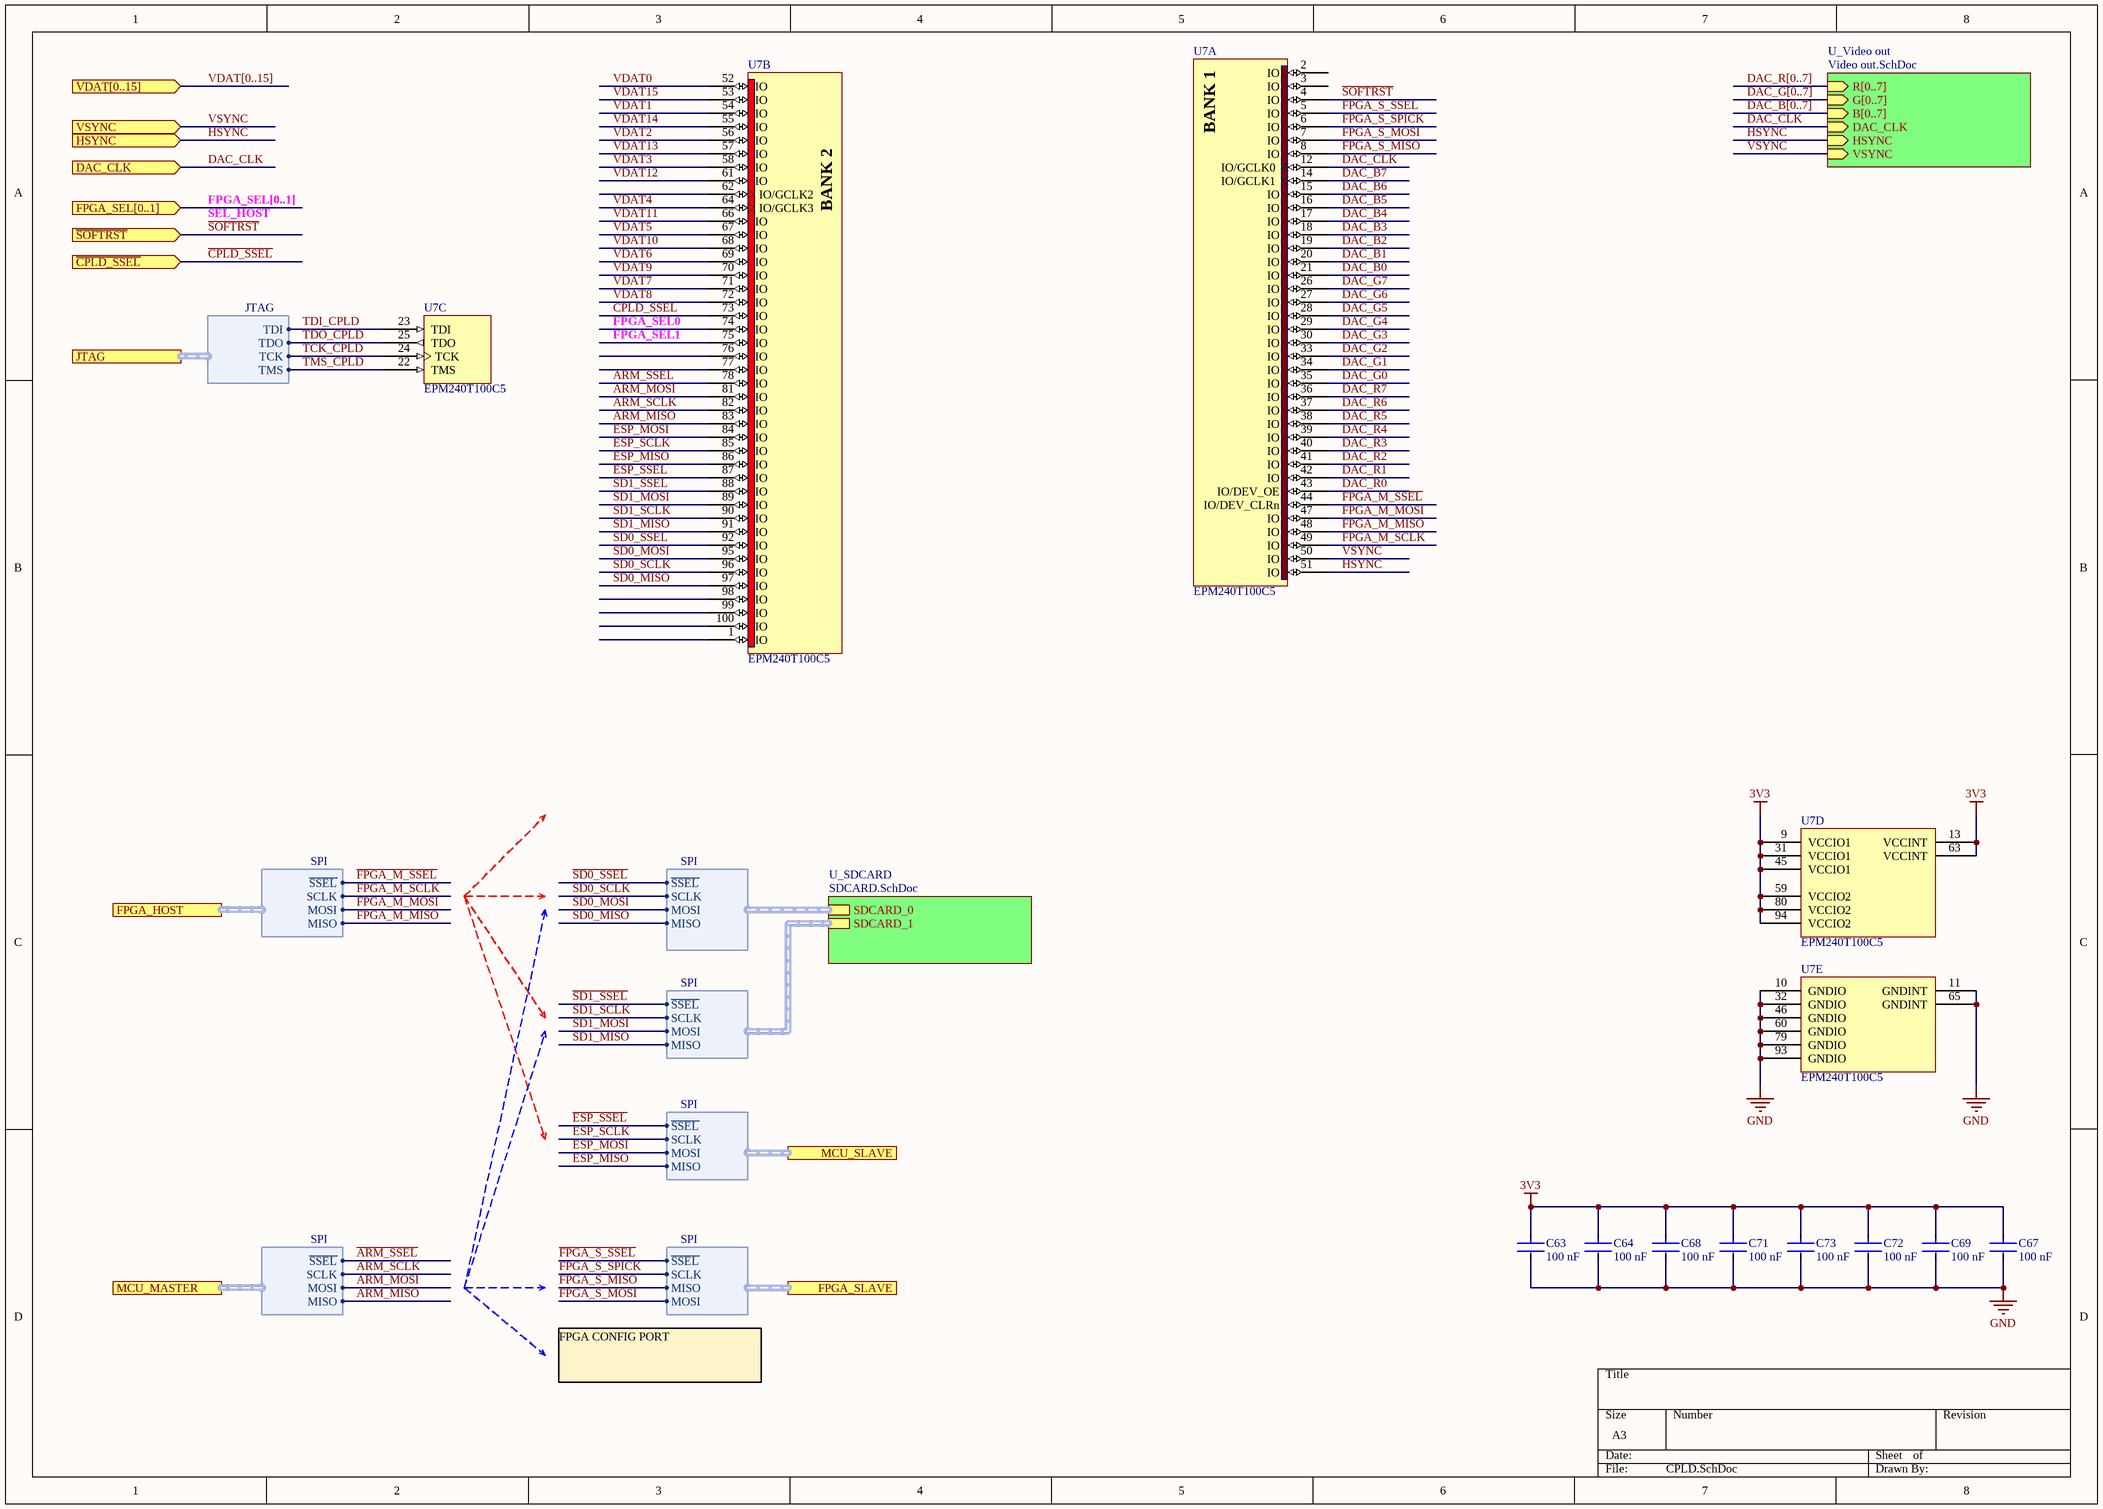
[diagram p4: CPLD.SchDoc]

### Parts
C63  Capacitance: 100 nF  [FP-CC0805-0_85-IPC_A]  (hidden comment: CC0805KRX7R9BB104)
C64  Capacitance: 100 nF  [FP-CC0805-0_85-IPC_A]  (hidden comment: CC0805KRX7R9BB104)
C67  Capacitance: 100 nF  [FP-CC0805-0_85-IPC_A]  (hidden comment: CC0805KRX7R9BB104)
C68  Capacitance: 100 nF  [FP-CC0805-0_85-IPC_A]  (hidden comment: CC0805KRX7R9BB104)
C69  Capacitance: 100 nF  [FP-CC0805-0_85-IPC_A]  (hidden comment: CC0805KRX7R9BB104)
C71  Capacitance: 100 nF  [FP-CC0805-0_85-IPC_A]  (hidden comment: CC0805KRX7R9BB104)
C72  Capacitance: 100 nF  [FP-CC0805-0_85-IPC_A]  (hidden comment: CC0805KRX7R9BB104)
C73  Capacitance: 100 nF  [FP-CC0805-0_85-IPC_A]  (hidden comment: CC0805KRX7R9BB104)
U7  EPM240T100C5  [TQFP100_M]  (parts A,B,C,D,E of 5)

### Sub-sheets
U_SDCARD = SDCARD.SchDoc: SDCARD_0 (harness SPI), SDCARD_1 (harness SPI)
U_Video out = Video out.SchDoc: R[0..7] (in), G[0..7] (in), B[0..7] (in), DAC_CLK (in), HSYNC (in), VSYNC (in)

### Ports
DAC_CLK (in), FPGA_HOST (harness SPI), FPGA_SEL[0..1] (in), FPGA_SLAVE (harness SPI), HSYNC (in), JTAG (harness JTAG), MCU_MASTER (harness SPI), MCU_SLAVE (harness SPI), VDAT[0..15] (in), VSYNC (in), ~{CPLD_SSEL} (in), ~{SOFTRST} (in)

### Harnesses
SPI: ~{SSEL}, SCLK, MOSI, MISO
JTAG: TCK, TDO, TDI, TMS

### Nets
3V3: C63.1 C64.1 C67.1 C68.1 C69.1 C71.1 C72.1 C73.1 U7.9(VCCIO1) U7.13(VCCINT) U7.31(VCCIO1) U7.45(VCCIO1) U7.59(VCCIO2) U7.63(VCCINT) U7.80(VCCIO2) U7.94(VCCIO2)
GND: C63.2 C64.2 C67.2 C68.2 C69.2 C71.2 C72.2 C73.2 U7.10(GNDIO) U7.11(GNDINT) U7.32(GNDIO) U7.46(GNDIO) U7.60(GNDIO) U7.65(GNDINT) U7.79(GNDIO) U7.93(GNDIO)
~{ARM_SSEL}: U7.78(IO) ; port MCU_MASTER.~{SSEL}  [project net ESP32_MASTER.~{SSEL}]
ARM_MISO: U7.83(IO) ; port MCU_MASTER.MISO  [project net ESP32_MASTER.MISO]
ARM_MOSI: U7.81(IO) ; port MCU_MASTER.MOSI  [project net ESP32_MASTER.MOSI]
ARM_SCLK: U7.82(IO) ; port MCU_MASTER.SCLK  [project net ESP32_MASTER.SCLK]
~{CPLD_SSEL}: U7.73(IO) ; port ~{CPLD_SSEL}
DAC_B0: U7.21(IO)  [project net DAC_B0_12]
DAC_B1: U7.20(IO)  [project net DAC_B1_12]
DAC_B2: U7.19(IO)  [project net DAC_B2_12]
DAC_B3: U7.18(IO)  [project net DAC_B3_12]
DAC_B4: U7.17(IO)  [project net DAC_B4_12]
DAC_B5: U7.16(IO)  [project net DAC_B5_12]
DAC_B6: U7.15(IO)  [project net DAC_B6_12]
DAC_B7: U7.14(IO/GCLK1)  [project net DAC_B7_12]
DAC_CLK: U7.12(IO/GCLK0) ; port DAC_CLK, sheet U_Video out/DAC_CLK
DAC_G0: U7.35(IO)  [project net DAC_G0_12]
DAC_G1: U7.34(IO)  [project net DAC_G1_12]
DAC_G2: U7.33(IO)  [project net DAC_G2_12]
DAC_G3: U7.30(IO)  [project net DAC_G3_12]
DAC_G4: U7.29(IO)  [project net DAC_G4_12]
DAC_G5: U7.28(IO)  [project net DAC_G5_12]
DAC_G6: U7.27(IO)  [project net DAC_G6_12]
DAC_G7: U7.26(IO)  [project net DAC_G7_12]
DAC_R0: U7.43(IO/DEV_OE)  [project net DAC_R0_12]
DAC_R1: U7.42(IO)  [project net DAC_R1_12]
DAC_R2: U7.41(IO)  [project net DAC_R2_12]
DAC_R3: U7.40(IO)  [project net DAC_R3_12]
DAC_R4: U7.39(IO)  [project net DAC_R4_12]
DAC_R5: U7.38(IO)  [project net DAC_R5_12]
DAC_R6: U7.37(IO)  [project net DAC_R6_12]
DAC_R7: U7.36(IO)  [project net DAC_R7_12]
~{ESP_SSEL}: U7.87(IO) ; port MCU_SLAVE.~{SSEL}  [project net ESP32_SLAVE.~{SSEL}]
ESP_MISO: U7.86(IO) ; port MCU_SLAVE.MISO  [project net ESP32_SLAVE.MISO]
ESP_MOSI: U7.84(IO) ; port MCU_SLAVE.MOSI  [project net ESP32_SLAVE.MOSI]
ESP_SCLK: U7.85(IO) ; port MCU_SLAVE.SCLK  [project net ESP32_SLAVE.SCLK]
~{FPGA_M_}~{SSEL}: U7.44(IO/DEV_CLRn) ; port FPGA_HOST.~{SSEL}  [project net SPI_HOST.~{SSEL}]
~{FPGA_S_SSEL}: U7.5(IO) ; port FPGA_SLAVE.~{SSEL}  [project net ~{SPI_SLAVE_SSEL}]
FPGA_M_MISO: U7.48(IO) ; port FPGA_HOST.MISO  [project net SPI_HOST.MISO]
FPGA_M_MOSI: U7.47(IO) ; port FPGA_HOST.MOSI  [project net SPI_HOST.MOSI]
FPGA_M_SCLK: U7.49(IO) ; port FPGA_HOST.SCLK  [project net SPI_HOST.SCLK]
FPGA_S_MISO: U7.8(IO) ; port FPGA_SLAVE.MISO  [project net SPI_SLAVE.MISO]
FPGA_S_MOSI: U7.7(IO) ; port FPGA_SLAVE.MOSI  [project net SPI_SLAVE.MOSI]
FPGA_S_SPICK: U7.6(IO) ; port FPGA_SLAVE.SCLK  [project net SPI_SLAVE.SCLK]
FPGA_SEL0: U7.74(IO)
FPGA_SEL1: U7.75(IO)
HSYNC: U7.51(IO) ; port HSYNC, sheet U_Video out/HSYNC
~{SD0_SSEL}: U7.92(IO) ; sheet U_SDCARD/SDCARD_0.~{SSEL}
~{SD1_SSEL}: U7.88(IO) ; sheet U_SDCARD/SDCARD_1.~{SSEL}
~{SOFTRST}: U7.4(IO) ; port ~{SOFTRST}
SD0_MISO: U7.97(IO) ; sheet U_SDCARD/SDCARD_0.MISO
SD0_MOSI: U7.95(IO) ; sheet U_SDCARD/SDCARD_0.MOSI
SD0_SCLK: U7.96(IO) ; sheet U_SDCARD/SDCARD_0.SCLK
SD1_MISO: U7.91(IO) ; sheet U_SDCARD/SDCARD_1.MISO
SD1_MOSI: U7.89(IO) ; sheet U_SDCARD/SDCARD_1.MOSI
SD1_SCLK: U7.90(IO) ; sheet U_SDCARD/SDCARD_1.SCLK
TCK_CPLD: U7.24(TCK) ; port JTAG.TCK  [project net TCK_FPGA]
TDI_CPLD: U7.23(TDI) ; port JTAG.TDI  [project net TDO_FPGA]
TDO_CPLD: U7.25(TDO) ; port JTAG.TDO
TMS_CPLD: U7.22(TMS) ; port JTAG.TMS  [project net TMS_FPGA]
VDAT0: U7.52(IO)
VDAT1: U7.54(IO)
VDAT2: U7.56(IO)
VDAT3: U7.58(IO)
VDAT4: U7.64(IO/GCLK3)
VDAT5: U7.67(IO)
VDAT6: U7.69(IO)
VDAT7: U7.71(IO)
VDAT8: U7.72(IO)
VDAT9: U7.70(IO)
VDAT10: U7.68(IO)
VDAT11: U7.66(IO)
VDAT12: U7.61(IO)
VDAT13: U7.57(IO)
VDAT14: U7.55(IO)
VDAT15: U7.53(IO)
VSYNC: U7.50(IO) ; port VSYNC, sheet U_Video out/VSYNC

Not connected (* = marked no-connect by the designer): U7 1(IO) 2(IO) 3(IO) 62(IO/GCLK2) 76(IO) 77(IO) 98(IO) 99(IO) 100(IO)

### Buses and harness runs
bus DAC_B[0..7] = sheet U_Video out/B[0..7]
bus DAC_G[0..7] = sheet U_Video out/G[0..7]
bus DAC_R[0..7] = sheet U_Video out/R[0..7]
bus FPGA_SEL[0..1] = port FPGA_SEL[0..1]
bus VDAT[0..15] = port VDAT[0..15]

### Notes on the sheet
- FPGA CONFIG PORT
- Labels drawn without touching a wire or pin: SEL_HOST
- (in symbol CMP-0144-00216-1, part A) BANK 1
- (in symbol CMP-0144-00216-1, part B) BANK 2
- (in symbol EPM240T100C5, part A) BANK 1
- (in symbol EPM240T100C5, part B) BANK 2

### Library data of the parts
C63 C64 C67-C69 C71-C73 = CMP-2100-03606-3: as C106 on sheet FPGA; Category: Cap; Manufacturer Part Number: CC0805KRX7R9BB104; Case/Package: 0805
U7 = CMP-0144-00216-1: MAX II 3.3/2.5V CPLD, 80 IOs, 240 Logic Elements, 100-Pin Plastic TQFP, Commercial Temperature, Speed Grade 5; Manufacturer: Intel Altera; PackageDescription: 100-Pin Plastic Thin Quad Flat Pack (TQFP100) - Wire Bond; Manufacturer Part Number: EPM240T100C5; value: EPM240T100C5; Case/Package: TQFP-100; Category: IC

## Sheet Video out.SchDoc
size A4; SheetNumber: 13; SheetTotal: 15
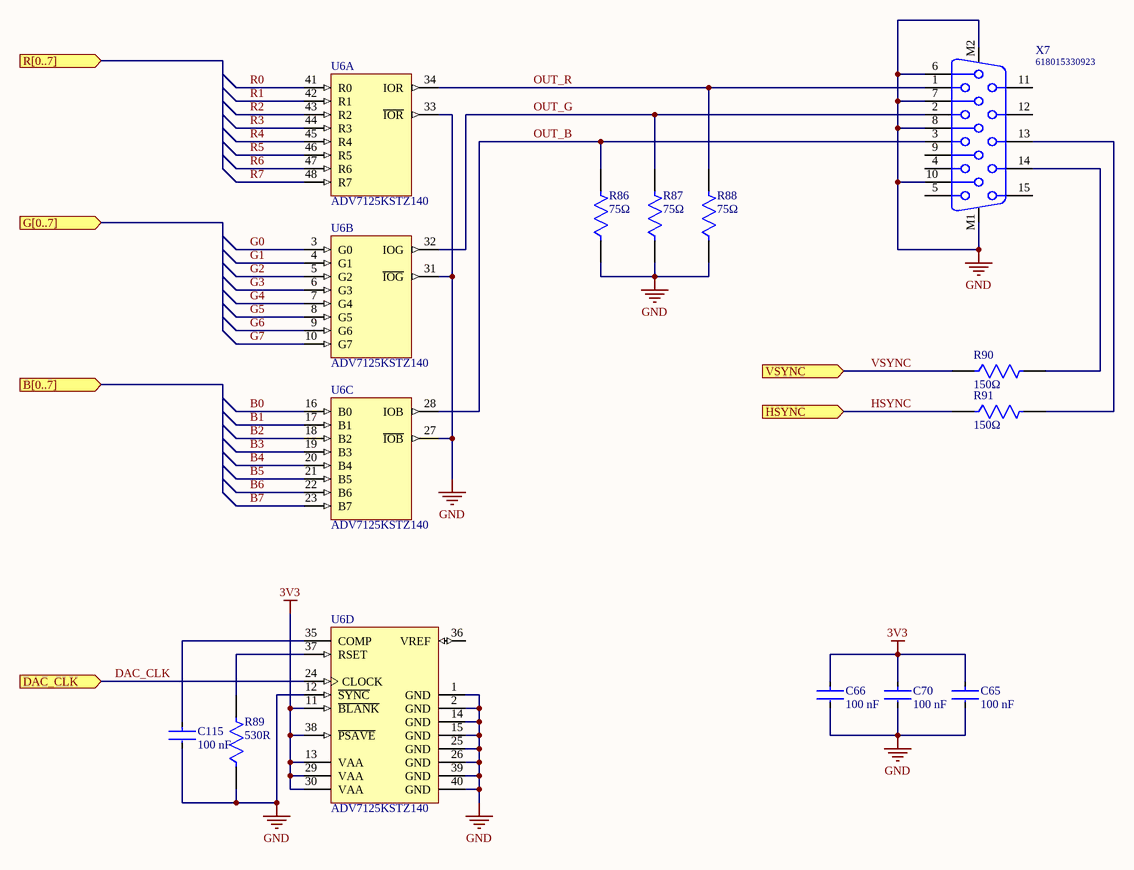
[diagram p5: Video out.SchDoc]

### Parts
C65  Capacitance: 100 nF  [FP-CC0805-0_85-IPC_A]  (hidden comment: CC0805KRX7R9BB104)
C66  Capacitance: 100 nF  [FP-CC0805-0_85-IPC_A]  (hidden comment: CC0805KRX7R9BB104)
C70  Capacitance: 100 nF  [FP-CC0805-0_85-IPC_A]  (hidden comment: CC0805KRX7R9BB104)
C115  Capacitance: 100 nF  [FP-CC0805-0_85-IPC_A]  (hidden comment: CC0805KRX7R9BB104)
R86  Resistance: 75Ω  [FP-RN732A-IPC_A]  (hidden comment: RN73C2A75RBTDF)
R87  Resistance: 75Ω  [FP-RN732A-IPC_A]  (hidden comment: RN73C2A75RBTDF)
R88  Resistance: 75Ω  [FP-RN732A-IPC_A]  (hidden comment: RN73C2A75RBTDF)
R89  Resistance: 530R  [FP-CRCW0805-HPe3-IPC_A]  (hidden comment: TNPW0805530RBETA)
R90  Resistance: 150Ω  [FP-RN732A-IPC_A]  (hidden comment: RN73C2A150RBTDF)
R91  Resistance: 150Ω  [FP-RN732A-IPC_A]  (hidden comment: RN73C2A150RBTDF)
U6  ADV7125KSTZ140  [ST-48_N]  (parts A,B,C,D of 4)
X7  618015330923  [618015330923]

### Ports
B[0..7] (in), DAC_CLK (in), G[0..7] (in), HSYNC (in), R[0..7] (in), VSYNC (in)

### Nets
3V3: C65.1 C66.1 C70.1 U6.11(~{BLANK}) U6.13(VAA) U6.29(VAA) U6.30(VAA) U6.38(~{PSAVE})
GND: C65.2 C66.2 C70.2 C115.2 R86.1 R87.1 R88.1 R89.1 U6.1(GND) U6.2(GND) U6.12(~{SYNC}) U6.14(GND) U6.15(GND) U6.25(GND) U6.26(GND) U6.27(~{IOB}) U6.31(~{IOG}) U6.33(~{IOR}) U6.39(GND) U6.40(GND) X7.6 X7.7 X7.8 X7.10 X7.M1 X7.M2
B0: U6.16(B0)  [project net B0_13]
B1: U6.17(B1)  [project net B1_13]
B2: U6.18(B2)  [project net B2_13]
B3: U6.19(B3)  [project net B3_13]
B4: U6.20(B4)  [project net B4_13]
B5: U6.21(B5)  [project net B5_13]
B6: U6.22(B6)  [project net B6_13]
B7: U6.23(B7)  [project net B7_13]
DAC_CLK: U6.24(CLOCK) ; port DAC_CLK
G0: U6.3(G0)  [project net G0_13]
G1: U6.4(G1)  [project net G1_13]
G2: U6.5(G2)  [project net G2_13]
G3: U6.6(G3)  [project net G3_13]
G4: U6.7(G4)  [project net G4_13]
G5: U6.8(G5)  [project net G5_13]
G6: U6.9(G6)  [project net G6_13]
G7: U6.10(G7)  [project net G7_13]
HSYNC: R91.1 ; port HSYNC
OUT_B: R86.2 U6.28(IOB) X7.3  [project net OUT_B_13]
OUT_G: R87.2 U6.32(IOG) X7.2  [project net OUT_G_13]
OUT_R: R88.2 U6.34(IOR) X7.1  [project net OUT_R_13]
R0: U6.41(R0)  [project net R0_13]
R1: U6.42(R1)  [project net R1_13]
R2: U6.43(R2)  [project net R2_13]
R3: U6.44(R3)  [project net R3_13]
R4: U6.45(R4)  [project net R4_13]
R5: U6.46(R5)  [project net R5_13]
R6: U6.47(R6)  [project net R6_13]
R7: U6.48(R7)  [project net R7_13]
VSYNC: R90.1 ; port VSYNC
NetC115_1: C115.1 U6.35(COMP)
NetR89_2: R89.2 U6.37(RSET)
NetR90_2: R90.2 X7.14
NetR91_2: R91.2 X7.13

Not connected (* = marked no-connect by the designer): U6 36(VREF); X7 4 5 9 11 12 15

### Library data of the parts
C65 C66 C70 C115 = CMP-2100-03606-3: as C106 on sheet FPGA; Manufacturer Part Number: CC0805KRX7R9BB104; Category: Cap; Case/Package: 0805
R86-R88 = CMP-03211-006560-1: SMD Chip Resistor, Thin Film, 75Ω, 100 V, 0805 [2012 Metric], 100 mW, 0.1%, RN73 Series; Manufacturer: TE Connectivity; Value: 75Ω; Category: Res; Manufacturer Part Number: RN73C2A75RBTDF; Case/Package: 0805
R89 = CMP-02407-005666-1: RES Thick Film, 560Ω, 1%, 0.5W, 100ppm/°C, 0805; Manufacturer: Vishay; Manufacturer Part Number: CRCW0805560RFKEAHP; value: 530Ω; Case/Package: 0805; Termination: Wraparound; Number of Terminations: 2; Category: Res
R90 R91 = CMP-03211-002331-1: SMD Chip Resistor, Thin Film, 150Ω, 100 V, 0805 [2012 Metric], 100 mW, 0.1%, RN73 Series; Manufacturer: TE Connectivity; Value: 150Ω; Manufacturer Part Number: RN73C2A150RBTDF; Category: Res; Case/Package: 0805
U6 = CMP-0318-00718-2: 3 Channel 8-Bit CMOS High Speed Video Digital-to-Analog Converter, -40 to +85 degC, ST-48, Pb-Free, Tray; Manufacturer: Analog Devices; PackageDescription: 48-Pin Thin Quad Flat Pack 0.5 mm Pitch; PartNumber: ADV7125KSTZ140; Manufacturer Part Number: ADV7125KSTZ140; value: ADV7125KSTZ140; Case/Package: TQFP-48; Category: IC
X7 = CMP-1502-00216-1: Female High Density PCB Connector with Hex Screw WR-DSUB, Angled, 15 pins; Manufacturer: Wurth Electronics; Manufacturer Part Number: 618015330923; value: DSUB, Angled, 15 pins; Case/Package: DSUB-15; Category: Connector

## Sheet SDCARD.SchDoc
size A4; SheetNumber: 14; SheetTotal: 15
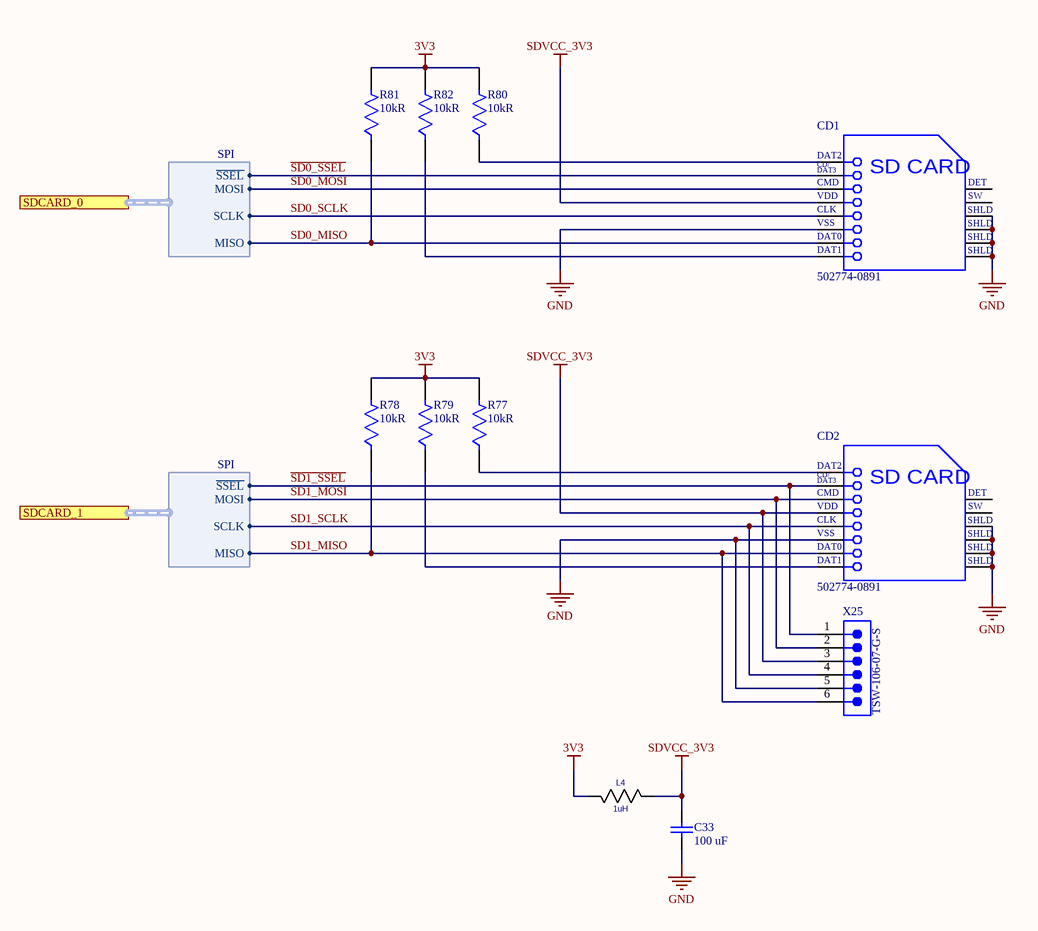
[diagram p6: SDCARD.SchDoc]

### Parts
C33  Capacitance: 100 uF  [CAPC3216X190X55ML30T25]  (hidden comment: GRM31CR60J107ME39L)
CD1  502774-0891  [MOLX-502774-0891_V]
CD2  502774-0891  [MOLX-502774-0891_V]
L4  value 1uH  [L-CHIP]  (hidden comment: L-CHIP)
R77  Resistance: 10kR  [FP-CR0805-IPC_A]  (hidden comment: CR0805-JW-103ELF)
R78  Resistance: 10kR  [FP-CR0805-IPC_A]  (hidden comment: CR0805-JW-103ELF)
R79  Resistance: 10kR  [FP-CR0805-IPC_A]  (hidden comment: CR0805-JW-103ELF)
R80  Resistance: 10kR  [FP-CR0805-IPC_A]  (hidden comment: CR0805-JW-103ELF)
R81  Resistance: 10kR  [FP-CR0805-IPC_A]  (hidden comment: CR0805-JW-103ELF)
R82  Resistance: 10kR  [FP-CR0805-IPC_A]  (hidden comment: CR0805-JW-103ELF)
X25  TSW-106-07-G-S  [SMTC-TSW-106-07-X-S]

### Ports
SDCARD_0 (harness SPI), SDCARD_1 (harness SPI)

### Harnesses
SPI: ~{SSEL}, SCLK, MOSI, MISO

### Nets
3V3: L4.2 R77.2 R78.2 R79.2 R80.2 R81.2 R82.2
GND: C33.1 CD1.6(VSS) CD1.11(SHLD) CD1.12(SHLD) CD1.13(SHLD) CD1.14(SHLD) CD2.6(VSS) CD2.11(SHLD) CD2.12(SHLD) CD2.13(SHLD) CD2.14(SHLD) X25.5
SDVCC_3V3: C33.2 CD1.4(VDD) CD2.4(VDD) L4.1 X25.3
~{SD0_SSEL}: CD1.2(CD/DAT3) ; port SDCARD_0.~{SSEL}
~{SD1_SSEL}: CD2.2(CD/DAT3) X25.1 ; port SDCARD_1.~{SSEL}
SD0_MISO: CD1.7(DAT0) R81.1 ; port SDCARD_0.MISO
SD0_MOSI: CD1.3(CMD) ; port SDCARD_0.MOSI
SD0_SCLK: CD1.5(CLK) ; port SDCARD_0.SCLK
SD1_MISO: CD2.7(DAT0) R78.1 X25.6 ; port SDCARD_1.MISO
SD1_MOSI: CD2.3(CMD) X25.2 ; port SDCARD_1.MOSI
SD1_SCLK: CD2.5(CLK) X25.4 ; port SDCARD_1.SCLK
NetCD1_1: CD1.1(DAT2) R80.1
NetCD1_8: CD1.8(DAT1) R82.1
NetCD2_1: CD2.1(DAT2) R77.1
NetCD2_8: CD2.8(DAT1) R79.1

Not connected (* = marked no-connect by the designer): CD1 9(DETECT) 10(SWITCH); CD2 9(DETECT) 10(SWITCH)

### Notes on the sheet
- (in symbol CMP-2000-05248-1) CD/; DAT3; SD CARD; DET; SW

### Library data of the parts
C33 = CMP-1662-00011-2: Chip Capacitor, 100 uF, +/- 20%, 6.3 V, -55 to 85 degC, 1206 (3216 Metric), RoHS, Tape and Reel; Manufacturer: Murata; value: 100 uF; PackageDescription: 2-Pin Surface Mount Device, Body 3.2 x 1.6 mm; PartNumber: GRM31CR60J107ME39L; Manufacturer Part Number: GRM31CR60J107ME39L; Case/Package: 1206; Category: Cap
CD1 CD2 = CMP-2000-05248-1: Micro SD Memory Card Connector, 0.5 A, 10 V (DC), -25 to 85 degC, 8-Pin SMT, RoHS, Tape and Reel; Manufacturer: Molex; Manufacturer Part Number: 5027740891; value: 5027740891; Category: Connector; Case/Package: Micro SD (molex 5027740891 )
R77-R82 = CMP-07231-003873-1: as R20 on sheet FPGA; Number of Terminations: 2; Termination: SMD/SMT; Number of Pins: 2; Case/Package: 0805; Manufacturer Part Number: CR0805-JW-103ELF; value: 10kΩ; Category: Res
X25 = CMP-1024-00383-1: as X22 on sheet FPGA; PackageDescription: .025[0.64] SQ. Post Terminal Strip Assembly; PartNumber: TSW-106-07-G-S; Manufacturer Part Number: TSW-106-07-G-S; Case/Package: PLS-6; Category: Connector
L4 = L-CHIP: Case/Package: 0805; Category: Inductor

## Sheet Power ATX.SchDoc
size A4; SheetNumber: 2; SheetTotal: 15
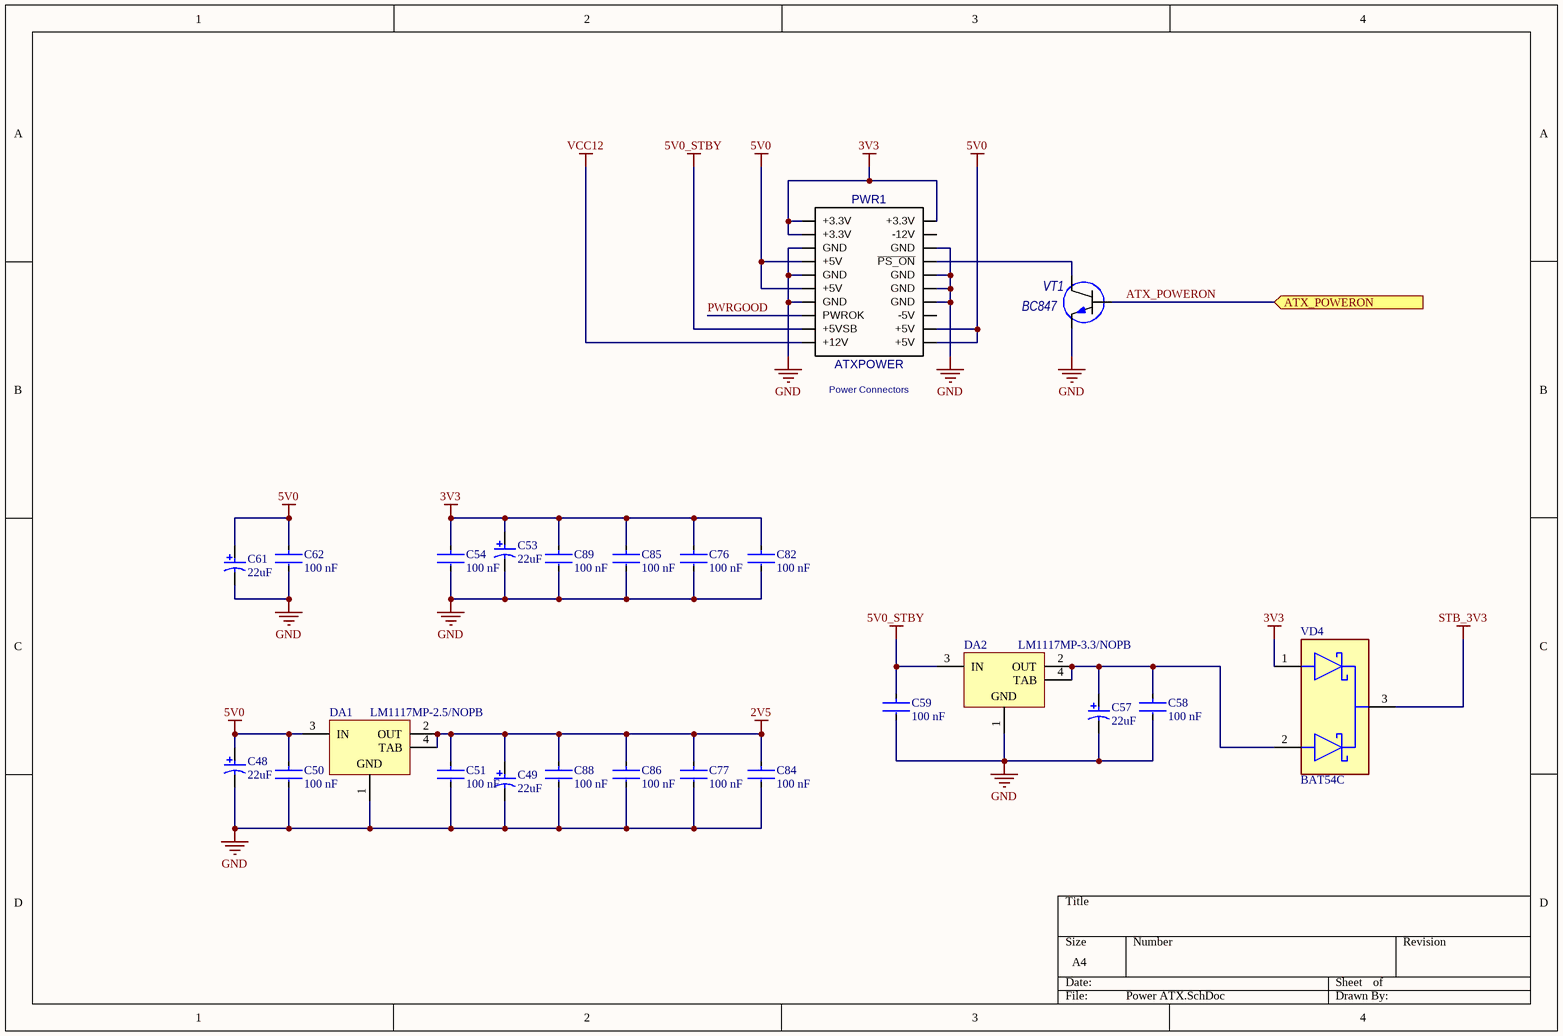
[diagram p7: Power ATX.SchDoc]

### Parts
C48  Capacitance: 22uF  [AVX-TAJ-B-2_M]  (hidden comment: TAJB226K016RNJ)
C49  Capacitance: 22uF  [AVX-TAJ-B-2_M]  (hidden comment: TAJB226K016RNJ)
C50  Capacitance: 100 nF  [FP-CC0805-0_85-IPC_A]  (hidden comment: CC0805KRX7R9BB104)
C51  Capacitance: 100 nF  [FP-CC0805-0_85-IPC_A]  (hidden comment: CC0805KRX7R9BB104)
C53  Capacitance: 22uF  [AVX-TAJ-B-2_M]  (hidden comment: TAJB226K016RNJ)
C54  Capacitance: 100 nF  [FP-CC0805-0_85-IPC_A]  (hidden comment: CC0805KRX7R9BB104)
C57  Capacitance: 22uF  [AVX-TAJ-B-2_M]  (hidden comment: TAJB226K016RNJ)
C58  Capacitance: 100 nF  [FP-CC0805-0_85-IPC_A]  (hidden comment: CC0805KRX7R9BB104)
C59  Capacitance: 100 nF  [FP-CC0805-0_85-IPC_A]  (hidden comment: CC0805KRX7R9BB104)
C61  Capacitance: 22uF  [AVX-TAJ-B-2_M]  (hidden comment: TAJB226K016RNJ)
C62  Capacitance: 100 nF  [FP-CC0805-0_85-IPC_A]  (hidden comment: CC0805KRX7R9BB104)
C76  Capacitance: 100 nF  [FP-CC0805-0_85-IPC_A]  (hidden comment: CC0805KRX7R9BB104)
C77  Capacitance: 100 nF  [FP-CC0805-0_85-IPC_A]  (hidden comment: CC0805KRX7R9BB104)
C82  Capacitance: 100 nF  [FP-CC0805-0_85-IPC_A]  (hidden comment: CC0805KRX7R9BB104)
C84  Capacitance: 100 nF  [FP-CC0805-0_85-IPC_A]  (hidden comment: CC0805KRX7R9BB104)
C85  Capacitance: 100 nF  [FP-CC0805-0_85-IPC_A]  (hidden comment: CC0805KRX7R9BB104)
C86  Capacitance: 100 nF  [FP-CC0805-0_85-IPC_A]  (hidden comment: CC0805KRX7R9BB104)
C88  Capacitance: 100 nF  [FP-CC0805-0_85-IPC_A]  (hidden comment: CC0805KRX7R9BB104)
C89  Capacitance: 100 nF  [FP-CC0805-0_85-IPC_A]  (hidden comment: CC0805KRX7R9BB104)
DA1  LM1117MP-2.5/NOPB  [DCY0004A_M]
DA2  LM1117MP-3.3/NOPB  [DCY0004A_L]
PWR1  ATXPOWER  [ATXPOWER]
VD4  BAT54C  [FP-MA03D-MFG]
VT1  BC847  [SOT-23]

### Ports
ATX_POWERON (in)

### Nets
2V5: C49.1 C51.1 C77.1 C84.1 C86.1 C88.1 DA1.2(OUT) DA1.4(TAB)
3V3: C53.1 C54.1 C76.1 C82.1 C85.1 C89.1 PWR1.1(+3.3V) PWR1.2(+3.3V) PWR1.11(+3.3V) VD4.1(1_ANODE)
5V0: C48.1 C50.1 C61.1 C62.1 DA1.3(IN) PWR1.4(+5V) PWR1.6(+5V) PWR1.19(+5V) PWR1.20(+5V)
5V0_STBY: C59.1 DA2.3(IN) PWR1.9(+5VSB)
GND: C48.2 C49.2 C50.2 C51.2 C53.2 C54.2 C57.2 C58.2 C59.2 C61.2 C62.2 C76.2 C77.2 C82.2 C84.2 C85.2 C86.2 C88.2 C89.2 DA1.1(GND) DA2.1(GND) PWR1.3(GND) PWR1.5(GND) PWR1.7(GND) PWR1.13(GND) PWR1.15(GND) PWR1.16(GND) PWR1.17(GND) VT1.2(emitter)
STB_3V3: VD4.3(COMMON_CATHODE)
VCC12: PWR1.10(+12V)
ATX_POWERON: VT1.1(base) ; port ATX_POWERON
PWRGOOD: PWR1.8(PWROK)  [project net PWRGOOD_2]
NetC57_1: C57.1 C58.1 DA2.2(OUT) DA2.4(TAB) VD4.2(2_ANODE)
NetPWR1_14: PWR1.14(~{PS_ON}) VT1.3(collector)

Not connected (* = marked no-connect by the designer): PWR1 12(-12V) 18(-5V)

### Notes on the sheet
- (near PWR1) Power Connectors

### Library data of the parts
C48 C49 C53 C57 C61 = CMP-2100-03689-1: as C11 on sheet BUS; Number of Pins: 2; Termination: SMD/SMT; Case/Package: 1210; Manufacturer Part Number: TAJB226K016RNJ; Category: Cap
C50 C51 C54 C58 C59 C62 C76 C77 C82 C84-C86 C88 C89 = CMP-2100-03606-3: as C106 on sheet FPGA; Manufacturer Part Number: CC0805KRX7R9BB104; Category: Cap; Case/Package: 0805
DA1 = CMP-0062-01660-4: 800mA Low-Dropout Linear Regulator, 4-pin SOT-223, Pb-Free; Manufacturer: TI National Semiconductor; PartNumber: LM1117MP-2.5/NOPB; PackageDescription: Molded SOT-223, 6.50 x 3.56 x 1.6mm Body, 4 Lead, 2.3mm Pitch; Manufacturer Part Number: LM1117MP-2.5/NOPB; value: LM1117MP-2.5/NOPB; Case/Package: SOT-223; Category: IC
DA2 = CMP-0062-01638-4: 800mA Low-Dropout Linear Regulator, 4-pin SOT-223, Pb-Free; Manufacturer: TI National Semiconductor; PackageDescription: Molded SOT-223, 6.50 x 3.56 x 1.6mm Body, 4 Lead, 2.3mm Pitch; PartNumber: LM1117MP-3.3/NOPB; Manufacturer Part Number: LM1117MP-3.3/NOPB; value: LM1117MP-3.3/NOPB; Case/Package: SOT-223; Category: IC
PWR1 = ATXPOWER: Analogs: MF-20MA;N42GP-20; Value: ATXPOWER; Case/Package: Mini-Fit 20 PIN 5.2; Category: Connector
VD4 = CMP-07162-000010-1: DIODE ARRAY SCHOTTKY 30V SOT23-3; Manufacturer: ON Semiconductor / Fairchild; Capacitance: 10pF; Category: Diode; Manufacturer Part Number: BAT54C; Value: BAT54C; Case/Package: SOT-23
VT1 = BC847: Value: BC847; Case/Package: SOT-23; Category: Transistor

## Sheet USB.SchDoc
size A4; SheetNumber: 7; SheetTotal: 15
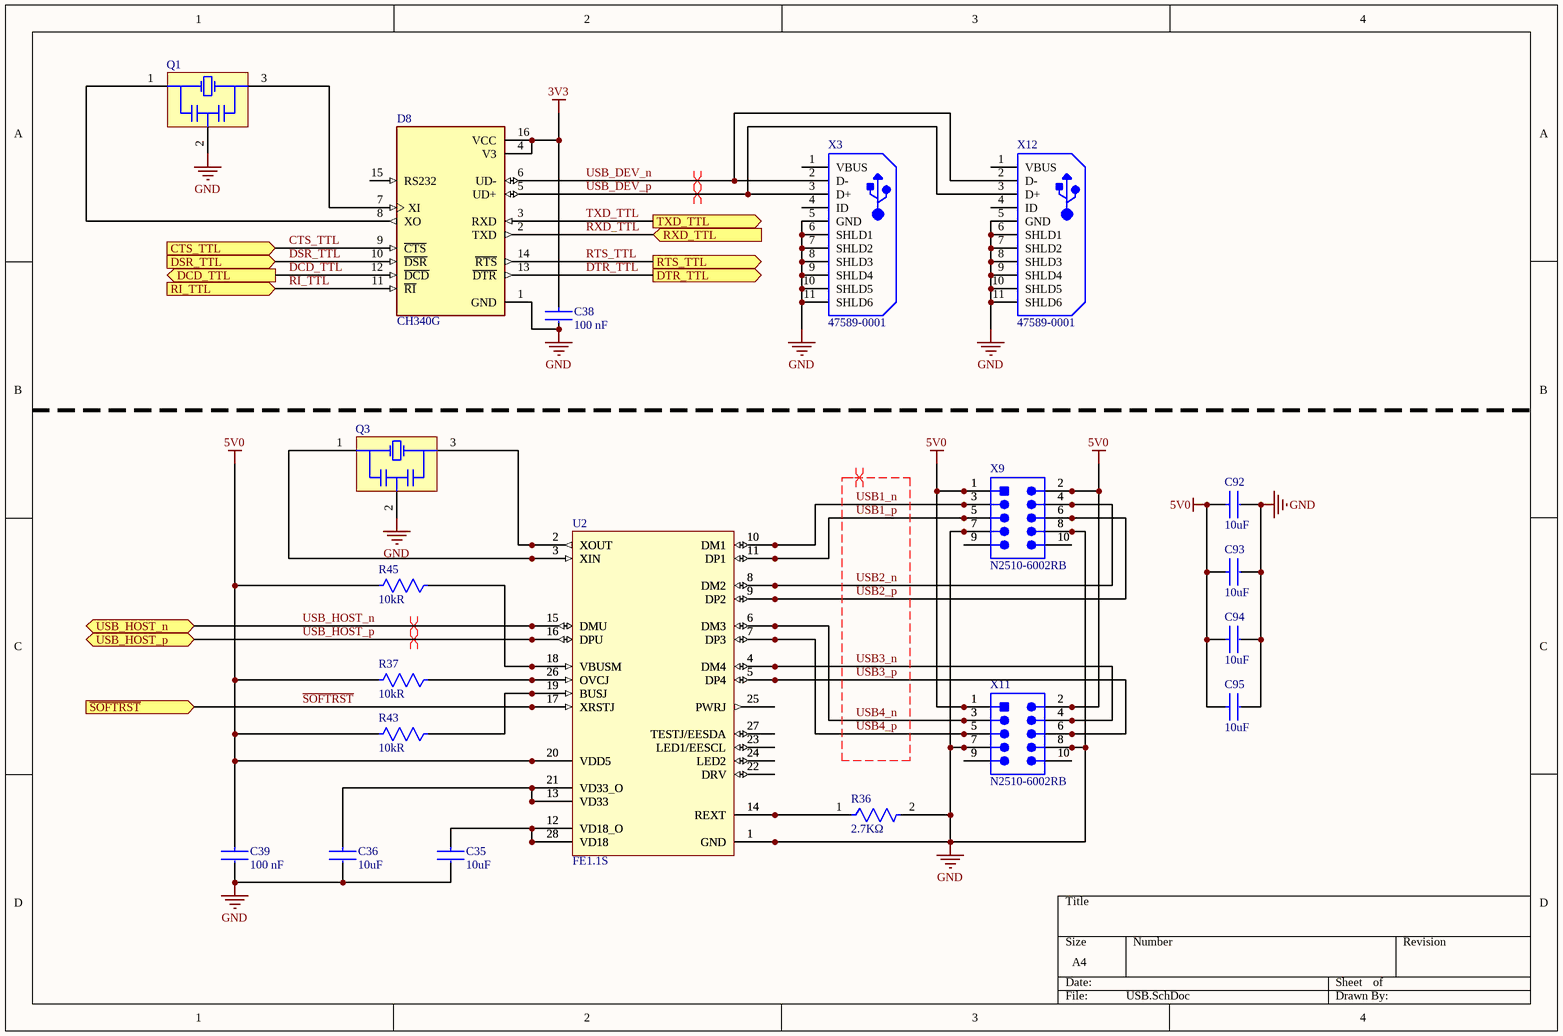
[diagram p8: USB.SchDoc]

### Parts
C35  Capacitance: 10uF  [FP-C0805C-DG-IPC_A]  (hidden comment: C0805C106K8PACTU)
C36  Capacitance: 10uF  [FP-C0805C-DG-IPC_A]  (hidden comment: C0805C106K8PACTU)
C38  Capacitance: 100 nF  [FP-CC0805-0_85-IPC_A]  (hidden comment: CC0805KRX7R9BB104)
C39  Capacitance: 100 nF  [FP-CC0805-0_85-IPC_A]  (hidden comment: CC0805KRX7R9BB104)
C92  Capacitance: 10uF  [FP-C0805C-DG-IPC_A]  (hidden comment: C0805C106K8PACTU)
C93  Capacitance: 10uF  [FP-C0805C-DG-IPC_A]  (hidden comment: C0805C106K8PACTU)
C94  Capacitance: 10uF  [FP-C0805C-DG-IPC_A]  (hidden comment: C0805C106K8PACTU)
C95  Capacitance: 10uF  [FP-C0805C-DG-IPC_A]  (hidden comment: C0805C106K8PACTU)
D8  CH340G  [SOIC127P600X180-16N]
Q1  CSTCE12M0G55Z-R0  [MURA-CSTCE_G_V]  (value not drawn)
Q3  CSTCE12M0G55Z-R0  [MURA-CSTCE_G_V]  (value not drawn)
R36  Resistance: 2.7KΩ  [FP-AC0805-IPC_A]  (hidden comment: AC0805FR-072K7L)
R37  Resistance: 10kR  [FP-CR0805-IPC_A]  (hidden comment: CR0805-JW-103ELF)
R43  Resistance: 10kR  [FP-CR0805-IPC_A]  (hidden comment: CR0805-JW-103ELF)
R45  Resistance: 10kR  [FP-CR0805-IPC_A]  (hidden comment: CR0805-JW-103ELF)
U2  FE1.1S  [TSOP64P600X160-28L]
X3  47589-0001  [MOLX-47589-0001_V]
X9  N2510-6002RB  [3M-N2510-6002-10_V]
X11  N2510-6002RB  [3M-N2510-6002-10_V]
X12  47589-0001  [MOLX-47589-0001_V]

### Ports
CTS_TTL (in), DCD_TTL (out), DSR_TTL (in), DTR_TTL (out), RI_TTL (in), RTS_TTL (out), RXD_TTL (in), TXD_TTL (out), USB_HOST_n (bidir), USB_HOST_p (bidir), ~{SOFTRST} (in)

### Nets
3V3: C38.1 D8.4(V3) D8.16(VCC)
5V0: C39.1 C92.1 C93.1 C94.1 C95.1 R37.2 R43.2 R45.2 U2.20(VDD5) X9.1 X9.2 X11.1 X11.2
GND: C35.2 C36.2 C38.2 C39.2 C92.2 C93.2 C94.2 C95.2 D8.1(GND) Q1.2(GND) Q3.2(GND) R36.2 U2.1(GND) X3.5(GND) X3.6(SHLD1) X3.7(SHLD2) X3.8(SHLD3) X3.9(SHLD4) X3.10(SHLD5) X3.11(SHLD6) X9.7 X9.8 X11.7 X11.8 X12.5(GND) X12.6(SHLD1) X12.7(SHLD2) X12.8(SHLD3) X12.9(SHLD4) X12.10(SHLD5) X12.11(SHLD6)
CTS_TTL: D8.9(~{CTS}) ; port CTS_TTL
DCD_TTL: D8.12(~{DCD}) ; port DCD_TTL
DSR_TTL: D8.10(~{DSR}) ; port DSR_TTL
DTR_TTL: D8.13(~{DTR}) ; port DTR_TTL
RI_TTL: D8.11(~{RI}) ; port RI_TTL
RTS_TTL: D8.14(~{RTS}) ; port RTS_TTL
RXD_TTL: D8.2(TXD) ; port RXD_TTL
~{SOFTRST}: U2.17(XRSTJ) ; port ~{SOFTRST}
TXD_TTL: D8.3(RXD) ; port TXD_TTL
USB1_n: U2.10(DM1) X9.3  [project net USB1_n_7]
USB1_p: U2.11(DP1) X9.5  [project net USB1_p_7]
USB2_n: U2.8(DM2) X9.4  [project net USB2_n_7]
USB2_p: U2.9(DP2) X9.6  [project net USB2_p_7]
USB3_n: U2.4(DM4) X11.4  [project net USB3_n_7]
USB3_p: U2.5(DP4) X11.6  [project net USB3_p_7]
USB4_n: U2.6(DM3) X11.3  [project net USB4_n_7]
USB4_p: U2.7(DP3) X11.5  [project net USB4_p_7]
USB_DEV_n: D8.6(UD-) X3.2(D-) X12.2(D-)  [project net USB_DEV_n_7]
USB_DEV_p: D8.5(UD+) X3.3(D+) X12.3(D+)  [project net USB_DEV_p_7]
USB_HOST_n: U2.15(DMU) ; port USB_HOST_n  [project net USB_n]
USB_HOST_p: U2.16(DPU) ; port USB_HOST_p  [project net USB_p]
NetC35_1: C35.1 U2.12(VD18_O) U2.28(VD18)
NetC36_1: C36.1 U2.13(VD33) U2.21(VD33_O)
NetD8_7: D8.7(XI) Q1.3(X2)
NetD8_8: D8.8(XO) Q1.1(X1)
NetQ3_1: Q3.1(X1) U2.3(XIN)
NetQ3_3: Q3.3(X2) U2.2(XOUT)
NetR36_1: R36.1 U2.14(REXT)
NetR37_1: R37.1 U2.26(OVCJ)
NetR43_1: R43.1 U2.19(BUSJ)
NetR45_1: R45.1 U2.18(VBUSM)

Not connected (* = marked no-connect by the designer): D8 15(RS232); U2 22(DRV) 23(LED1/EESCL) 24(LED2) 25(PWRJ) 27(TESTJ/EESDA); X3 1(VBUS) 4(ID); X9 9 10; X11 9 10; X12 1(VBUS) 4(ID)

### Layout directives
differential pair: USB1_n, USB1_p, USB2_n, USB2_p, USB3_n, USB3_p, USB4_n, USB4_p, USB_DEV_n_7, USB_DEV_p_7, USB_n, USB_p

### Library data of the parts
C35 C36 C92-C95 = CMP-2007-03243-2: CAP CER 10UF 10V X5R 0805; Manufacturer: KEMET; Manufacturer Part Number: C0805C106K8PACTU; Value: 10uF; Category: Cap; Case/Package: 0805
C38 C39 = CMP-2100-03606-3: as C106 on sheet FPGA; Category: Cap; Manufacturer Part Number: CC0805KRX7R9BB104; Case/Package: 0805
D8 = CH340G: USB Interface Integrated Circuit; Value: CH340G; Case/Package: SOIC-16; Category: IC
Q1 Q3 = CMP-2000-06123-1: Ceramic Resonator, 12 MHz, +/- 0.5%, -40 to 125 degC, 3-Pin SMD, RoHS, Tape and Reel; Manufacturer: Murata; Capacitance: 33pF; Category: CrystalsandOscillators; Manufacturer Part Number: CSTCE12M0G55Z-R0; value: CSTCE12M0G55Z-R0
R36 = CMP-2001-04496-2: RES SMD 2.7K OHM 1% 1/8W 0805; Manufacturer: Yageo; Value: 2.7KΩ; Manufacturer Part Number: AC0805FR-072K7L; Category: Res; Case/Package: 0805
R37 R43 R45 = CMP-07231-003873-1: as R20 on sheet FPGA; Number of Terminations: 2; Termination: SMD/SMT; Number of Pins: 2; Case/Package: 0805; Manufacturer Part Number: CR0805-JW-103ELF; value: 10kΩ; Category: Res
U2 = FE1.1S: USB 2.0 HIGH SPEED 4-PORT HUB CONTROLLER; Manufacturer: Terminus Technology Inc; value: FE1.1S; Case/Package: SSOP-28; Category: IC
X3 X12 = CMP-2000-05610-1: Right Angle Female Type AB Micro USB Connector, 30 V, 1.8 A, -30 to 85 degC, RoHS, Tape and Reel; Manufacturer: Molex; Manufacturer Part Number: 47589-0001; value: 47589-0001; Case/Package: Micro USB  (molex 47589-0001); Category: Connector
X9 X11 = CMP-2000-06794-1: as X15 on sheet FPGA; Manufacturer Part Number: N2510-6002RB; Case/Package: IDC-10; Category: Connector

## Sheet Gamepads.SchDoc
size A4; SheetNumber: 10; SheetTotal: 15
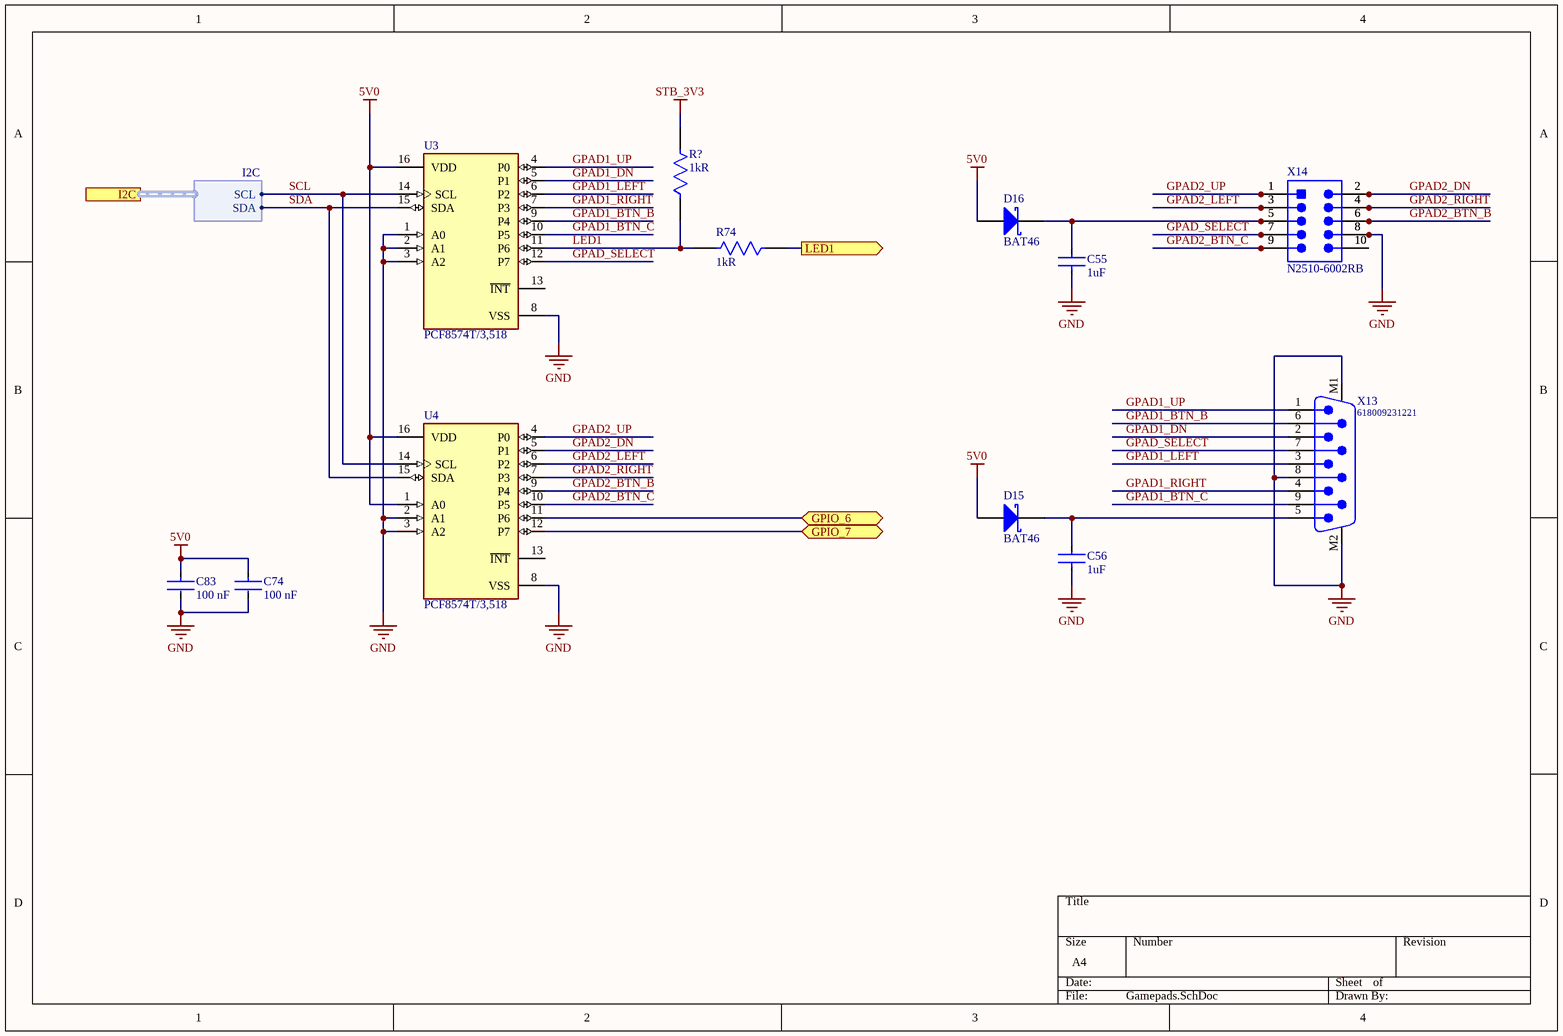
[diagram p9: Gamepads.SchDoc]

### Parts
C55  Capacitance: 1uF  [FP-GCM21B-0_15-IPC_A]  (hidden comment: GCM21BR71E105KA56L)
C56  Capacitance: 1uF  [FP-GCM21B-0_15-IPC_A]  (hidden comment: GCM21BR71E105KA56L)
C74  Capacitance: 100 nF  [FP-CC0805-0_85-IPC_A]  (hidden comment: CC0805KRX7R9BB104)
C83  Capacitance: 100 nF  [FP-CC0805-0_85-IPC_A]  (hidden comment: CC0805KRX7R9BB104)
D15  BAT46  [STM-DO-35-2]
D16  BAT46  [STM-DO-35-2]
R74  Resistance: 1kR  [FP-MCR10-IPC_A]  (hidden comment: MCR10ERTJ102)
R?  Resistance: 1kR  [FP-MCR10-IPC_A]  (hidden comment: MCR10ERTJ102)
U3  PCF8574T/3,518  [FP-SOT162-1-MFG]
U4  PCF8574T/3,518  [FP-SOT162-1-MFG]
X13  618009231221  [618009231221]
X14  N2510-6002RB  [3M-N2510-6002-10_V]

### Ports
GPIO_6 (bidir), GPIO_7 (bidir), I2C (harness I2C), LED1 (out)

### Harnesses
I2C: SDA, SCL

### Nets
5V0: C74.1 C83.1 D15.1(A) D16.1(A) U3.16(VDD) U4.1(A0) U4.16(VDD)
GND: C55.1 C56.1 C74.2 C83.2 U3.1(A0) U3.2(A1) U3.3(A2) U3.8(VSS) U4.2(A1) U4.3(A2) U4.8(VSS) X13.8 X13.M1 X13.M2 X14.8
STB_3V3: R?.2
GPAD1_BTN_B: U3.9(P4) X13.6  [project net GPAD1_BTN_B_10]
GPAD1_BTN_C: U3.10(P5) X13.9  [project net GPAD1_BTN_C_10]
GPAD1_DN: U3.5(P1) X13.2  [project net GPAD1_DN_10]
GPAD1_LEFT: U3.6(P2) X13.3  [project net GPAD1_LEFT_10]
GPAD1_RIGHT: U3.7(P3) X13.4  [project net GPAD1_RIGHT_10]
GPAD1_UP: U3.4(P0) X13.1  [project net GPAD1_UP_10]
GPAD2_BTN_B: U4.9(P4) X14.6  [project net GPAD2_BTN_B_10]
GPAD2_BTN_C: U4.10(P5) X14.9  [project net GPAD2_BTN_C_10]
GPAD2_DN: U4.5(P1) X14.2  [project net GPAD2_DN_10]
GPAD2_LEFT: U4.6(P2) X14.3  [project net GPAD2_LEFT_10]
GPAD2_RIGHT: U4.7(P3) X14.4  [project net GPAD2_RIGHT_10]
GPAD2_UP: U4.4(P0) X14.1  [project net GPAD2_UP_10]
GPAD_SELECT: U3.12(P7) X13.7 X14.7  [project net GPAD_SELECT_10]
LED1: R74.2 R?.1 U3.11(P6)  [project net LED1_10]
SCL: U3.14(SCL) U4.14(SCL) ; port I2C.SCL  [project net I2C.SCL]
SDA: U3.15(SDA) U4.15(SDA) ; port I2C.SDA  [project net I2C.SDA]
NetC55_2: C55.2 D16.2(K) X14.5
NetC56_2: C56.2 D15.2(K) X13.5
NetR74_1: R74.1 ; port LED1
NetU4_11: U4.11(P6) ; port GPIO_6
NetU4_12: U4.12(P7) ; port GPIO_7

Not connected (* = marked no-connect by the designer): U3 13(~{INT}); U4 13(~{INT}); X14 10

### Library data of the parts
C55 C56 = CMP-2007-03346-2: Ceramic Capacitor for Automotive 1uF ±10% 25VDC X7R 0805 Embossed T/R; Manufacturer: Murata; Termination: SMD/SMT; Case/Package: 0805; Manufacturer Part Number: GCM21BR71E105KA56L; value: 1uF; Category: Cap
C74 C83 = CMP-2100-03606-3: as C106 on sheet FPGA; Category: Cap; Manufacturer Part Number: CC0805KRX7R9BB104; Case/Package: 0805
D15 D16 = CMP-2000-05926-1: Small Signal Schottky Diode, 150 mA, 100 V, -65 to 125 degC, 2-Pin DO-35, RoHS, Tape and Reel; Manufacturer: STMicroelectronics; Manufacturer Part Number: BAT46; value: BAT46; Category: Diode
R74 R? = CMP-08839-004390-1: Thick Film Chip Resistor, 0805, 1kΩ, 5%, 200ppm/°C, 0.125W, 150V; Manufacturer: Rohm; Case/Package: 0805; Number of Terminations: 2; Manufacturer Part Number: MCR10ERTJ102; value: 1kΩ; Category: Res
U3 U4 = CMP-10112-000010-1: IC I/O EXPANDER I2C 8B 16SOIC; Manufacturer: NXP Semiconductors; Manufacturer Part Number: PCF8574T/3,518; Category: IC; value: PCF8574T/3,518; Case/Package: SOT162-1
X13 = CMP-1502-00284-1: Male PCB Connector with Hex Screw WR-DSUB, 8.08 mm, Angled, 9 pins; Manufacturer: Wurth Electronics; value: DSUB, Angled, 9 pins; Manufacturer Part Number: 618009231221; Case/Package: DSUB-9; Category: Connector
X14 = CMP-2000-06794-1: as X15 on sheet FPGA; Manufacturer Part Number: N2510-6002RB; Case/Package: IDC-10; Category: Connector